# EasyEDA Pro project ProPrj_WriteBotDriver_2025-05-26.epro, schematic Schematic

## Sheets
1 MCU: Board Name: Board1; Create Date: 2025-04-28; Page Name: MCU; Project Name: WriteBotDriver; Schematic Name: Schematic; Update Date: 2025-05-12; Company: 嘉立创EDA; Page Size: A4; Version: V1.0
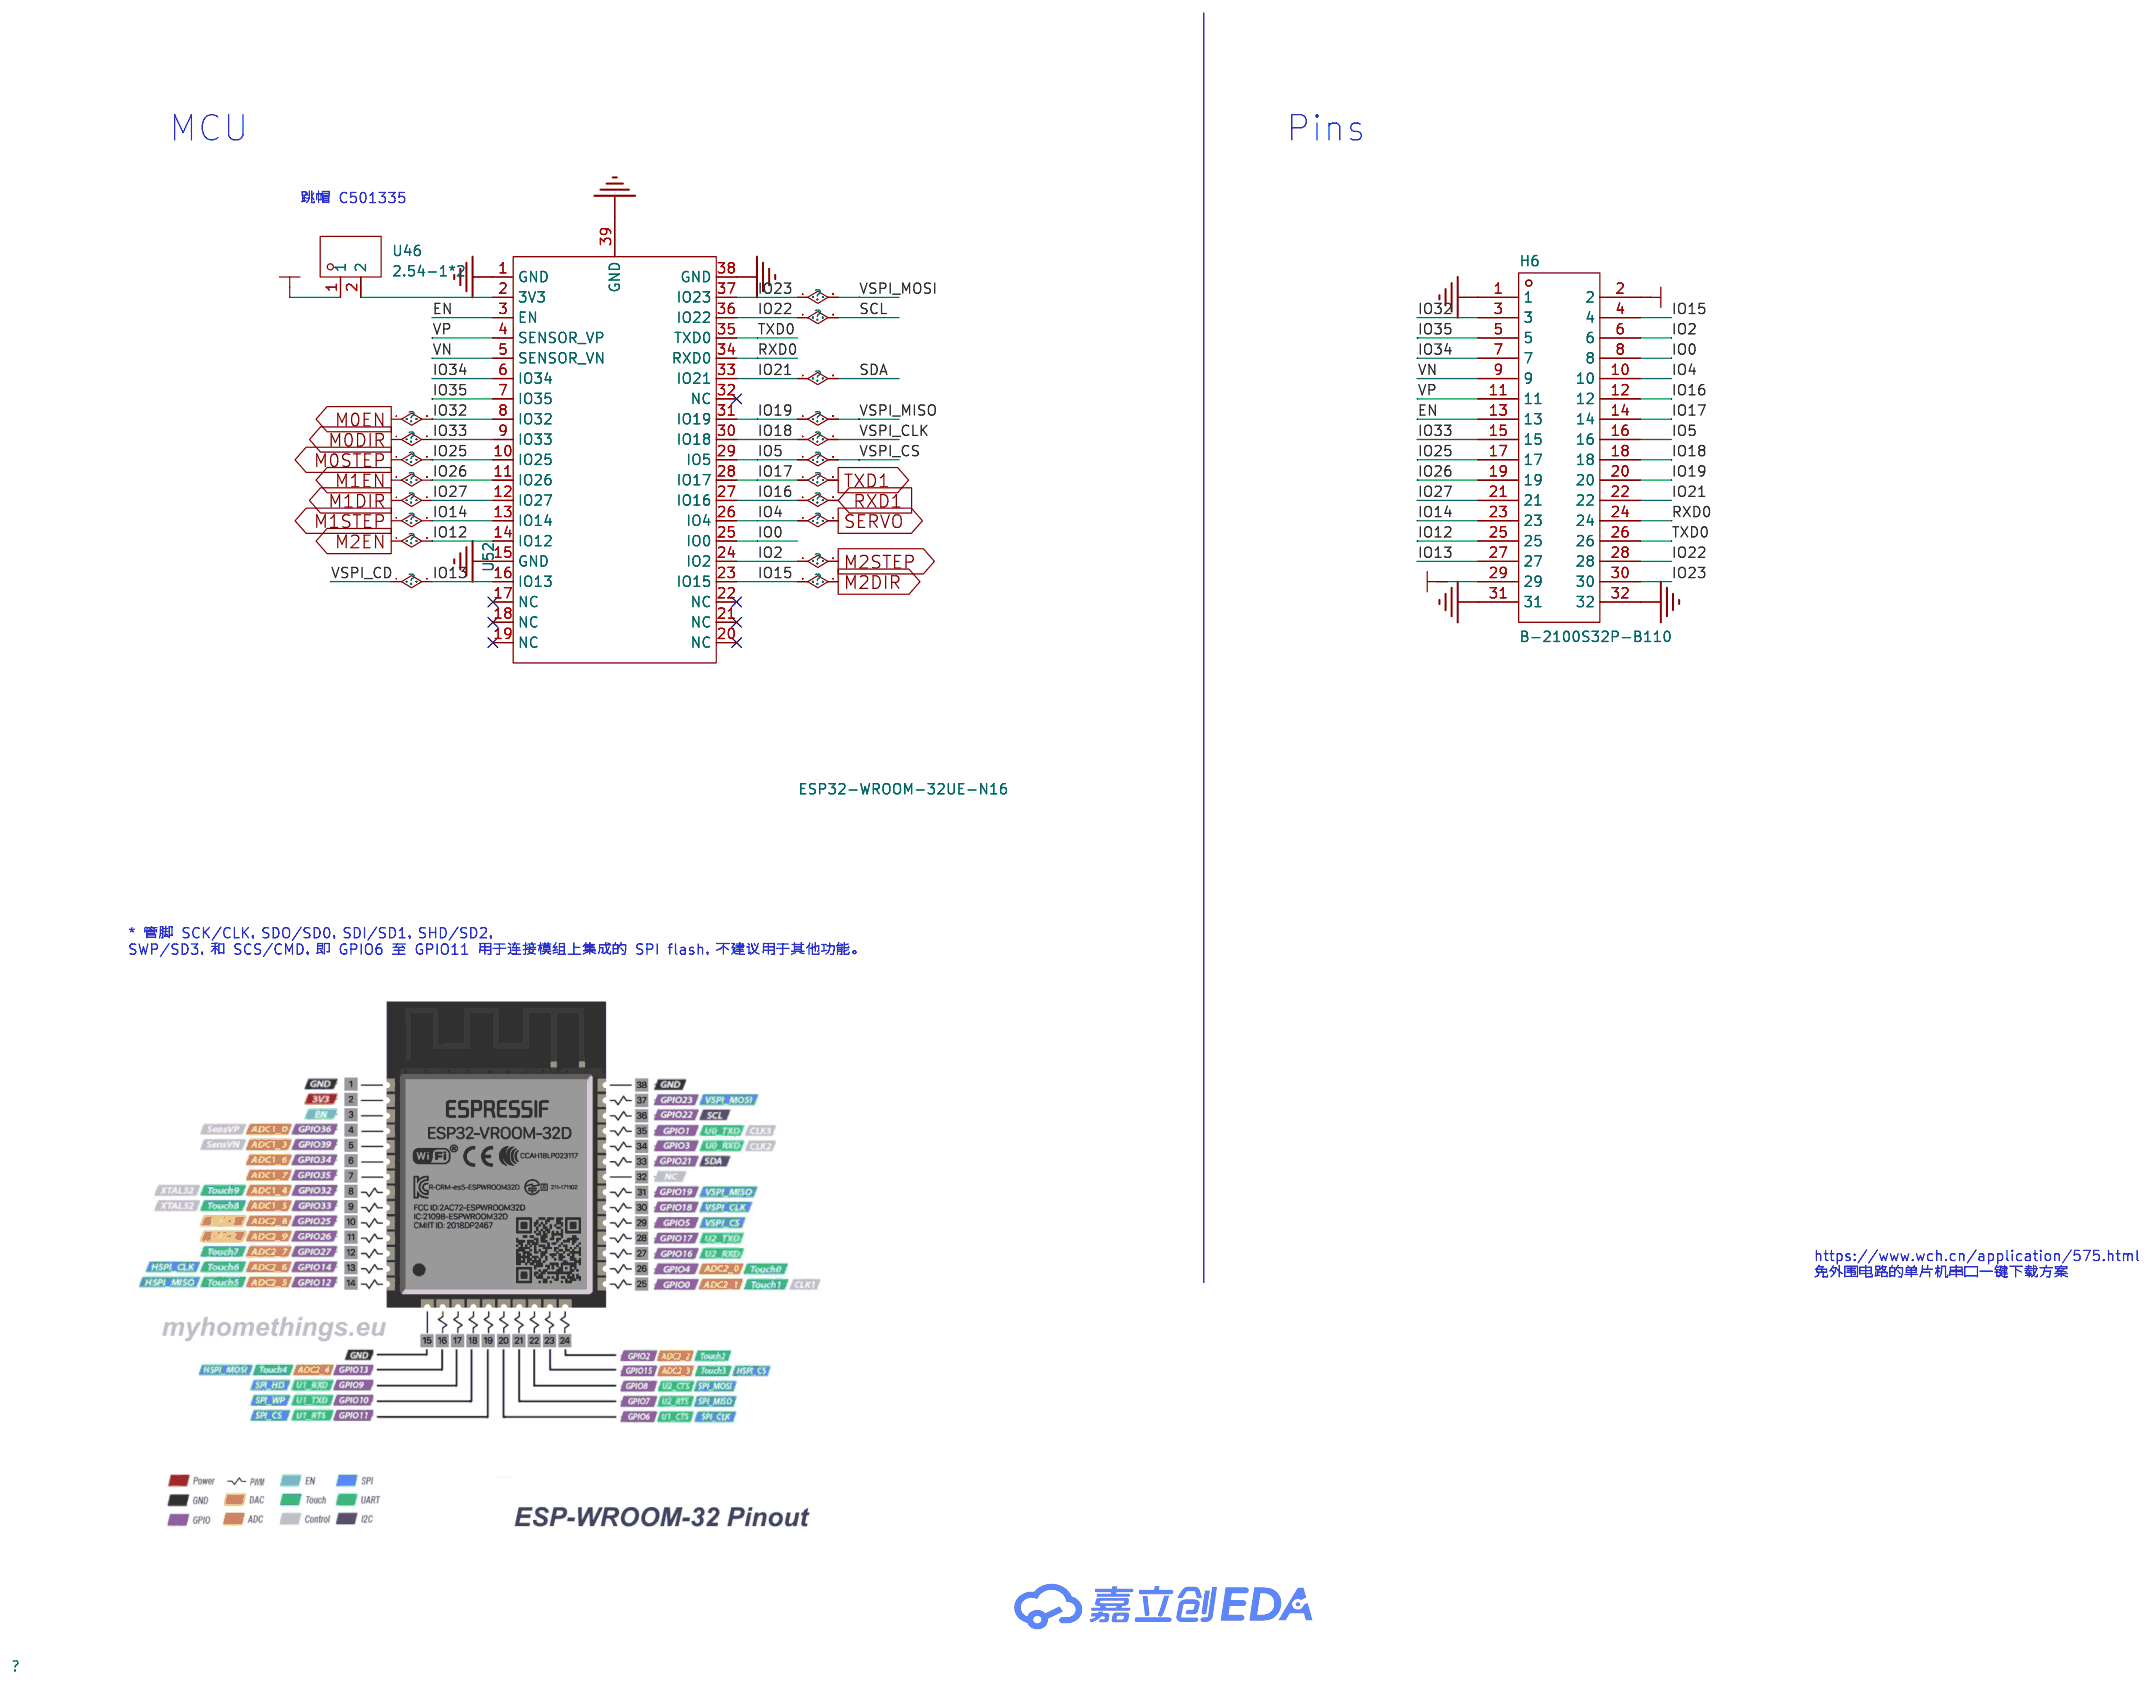
[diagram p0: MCU]
2 DRIVER: Page Name: DRIVER; Update Date: 2025-05-17
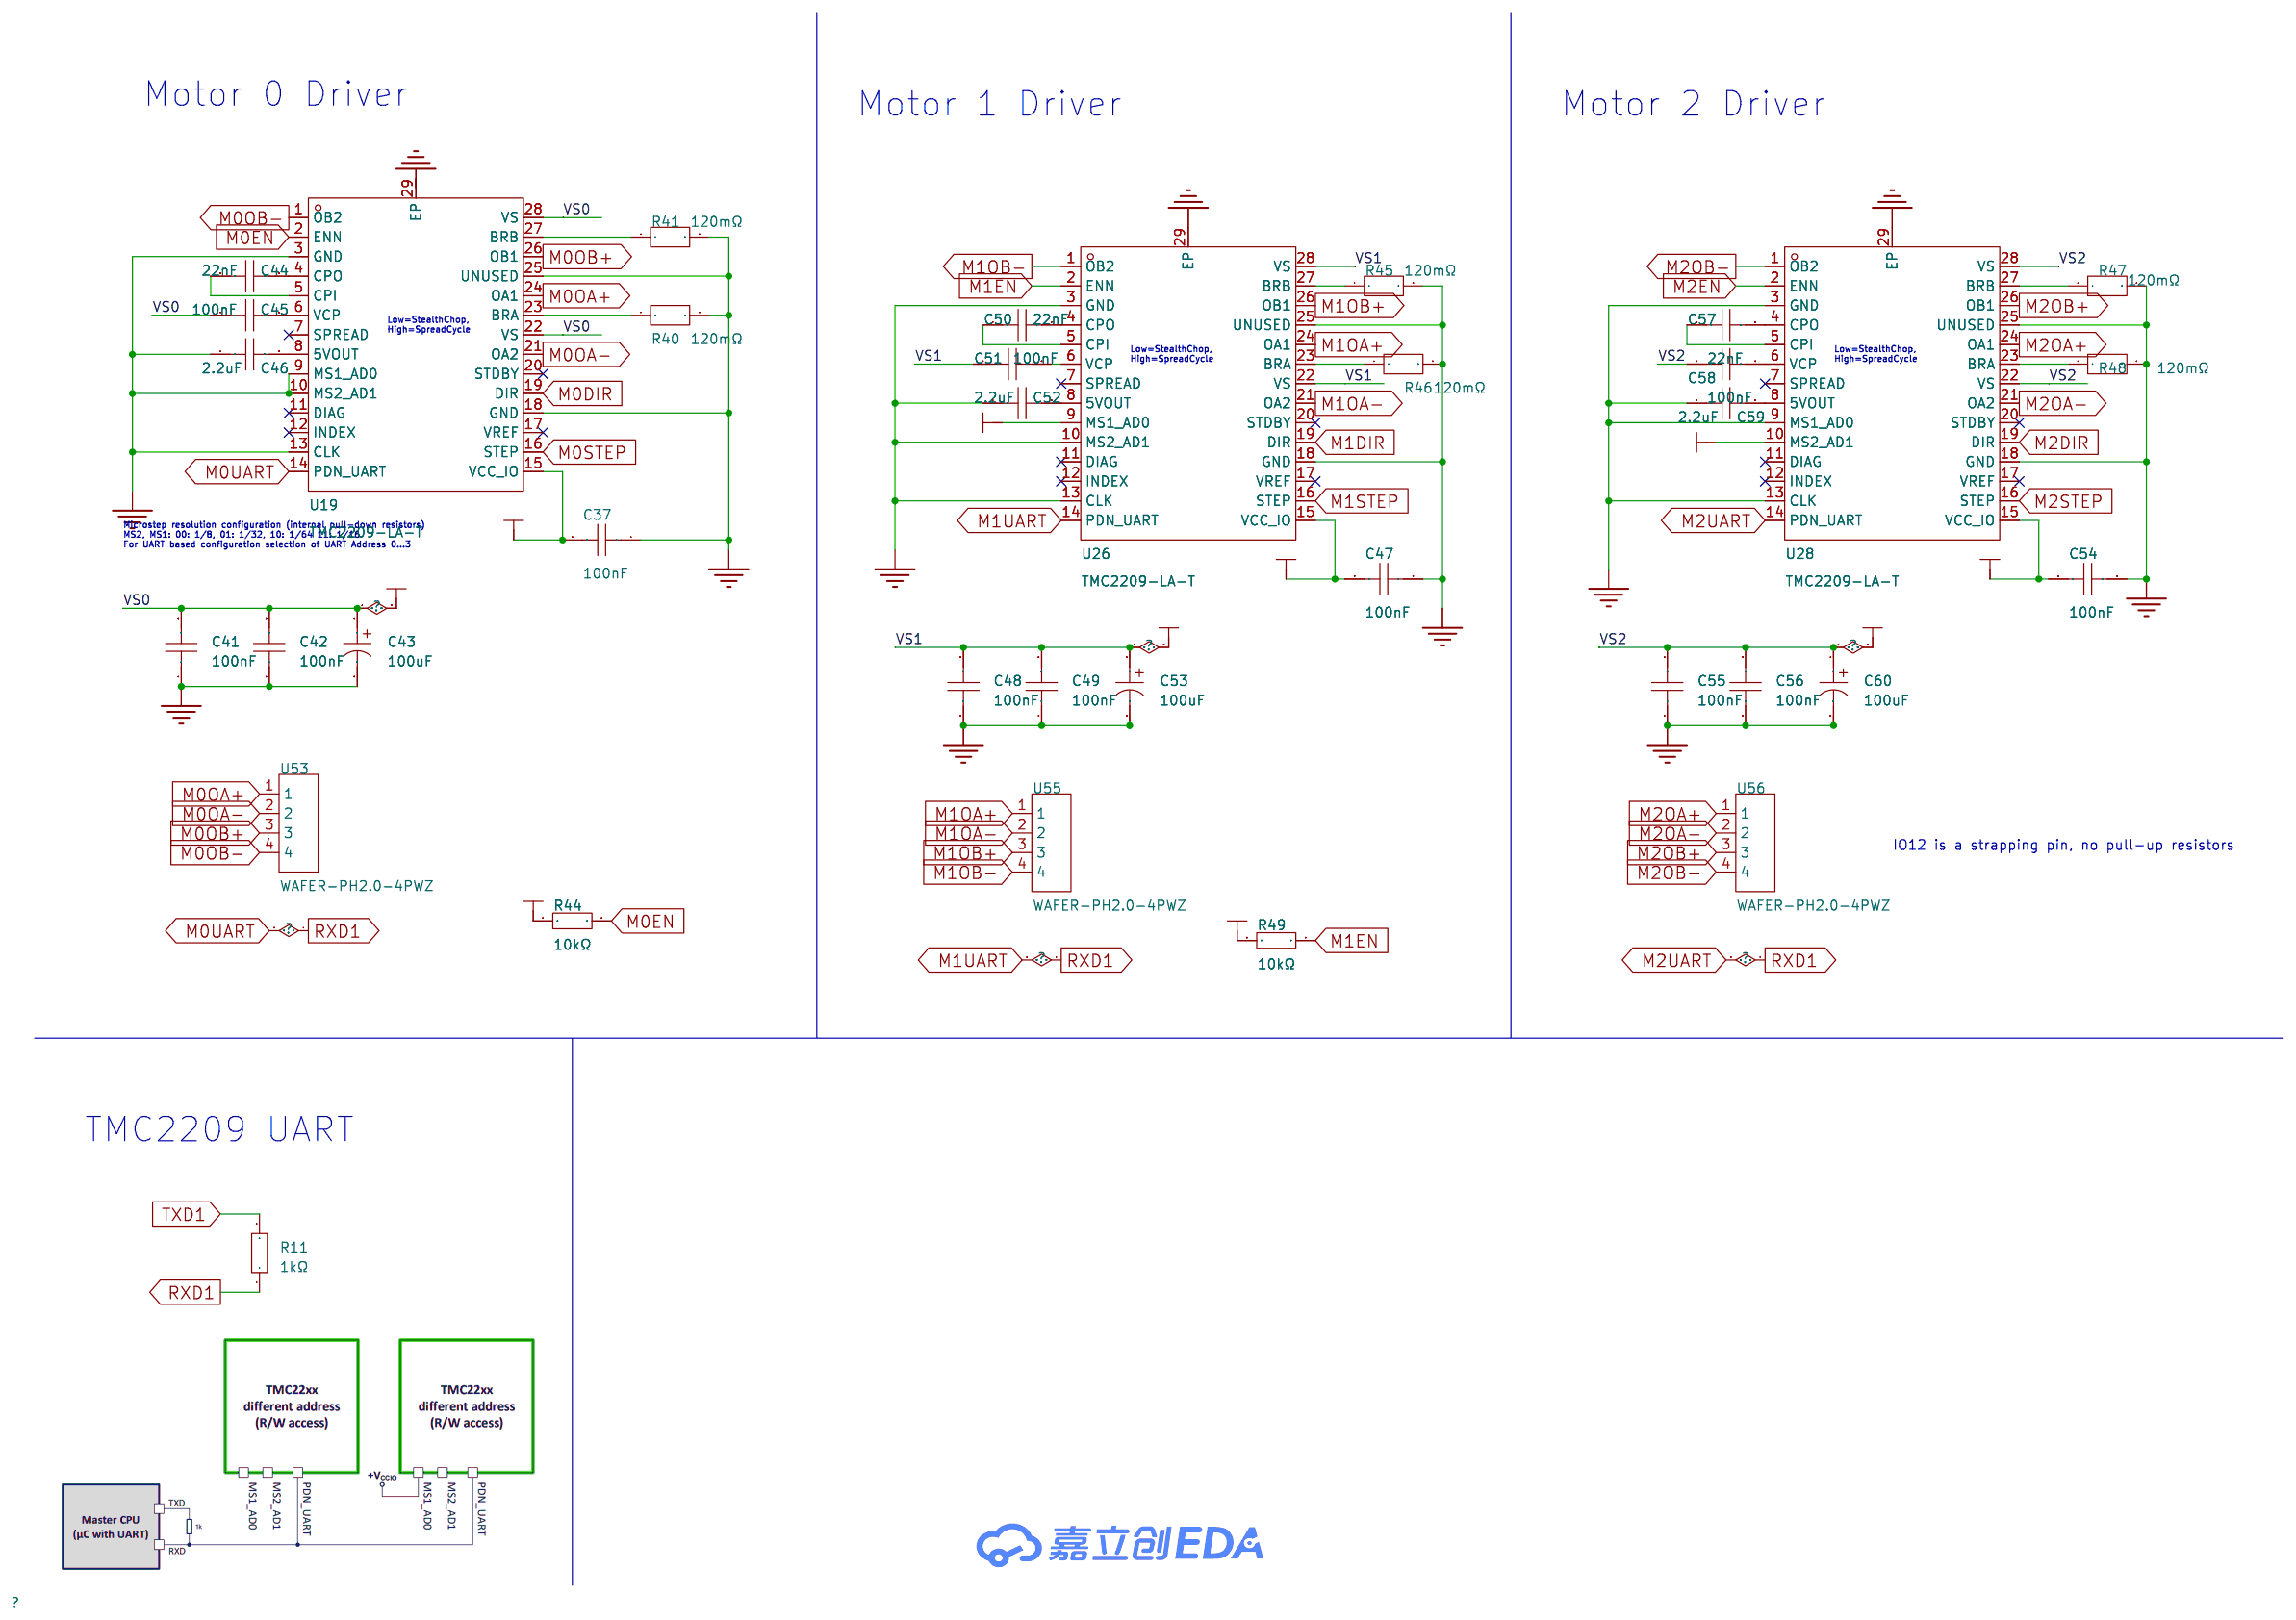
[diagram p1: DRIVER]
3 POWER: Page Name: POWER
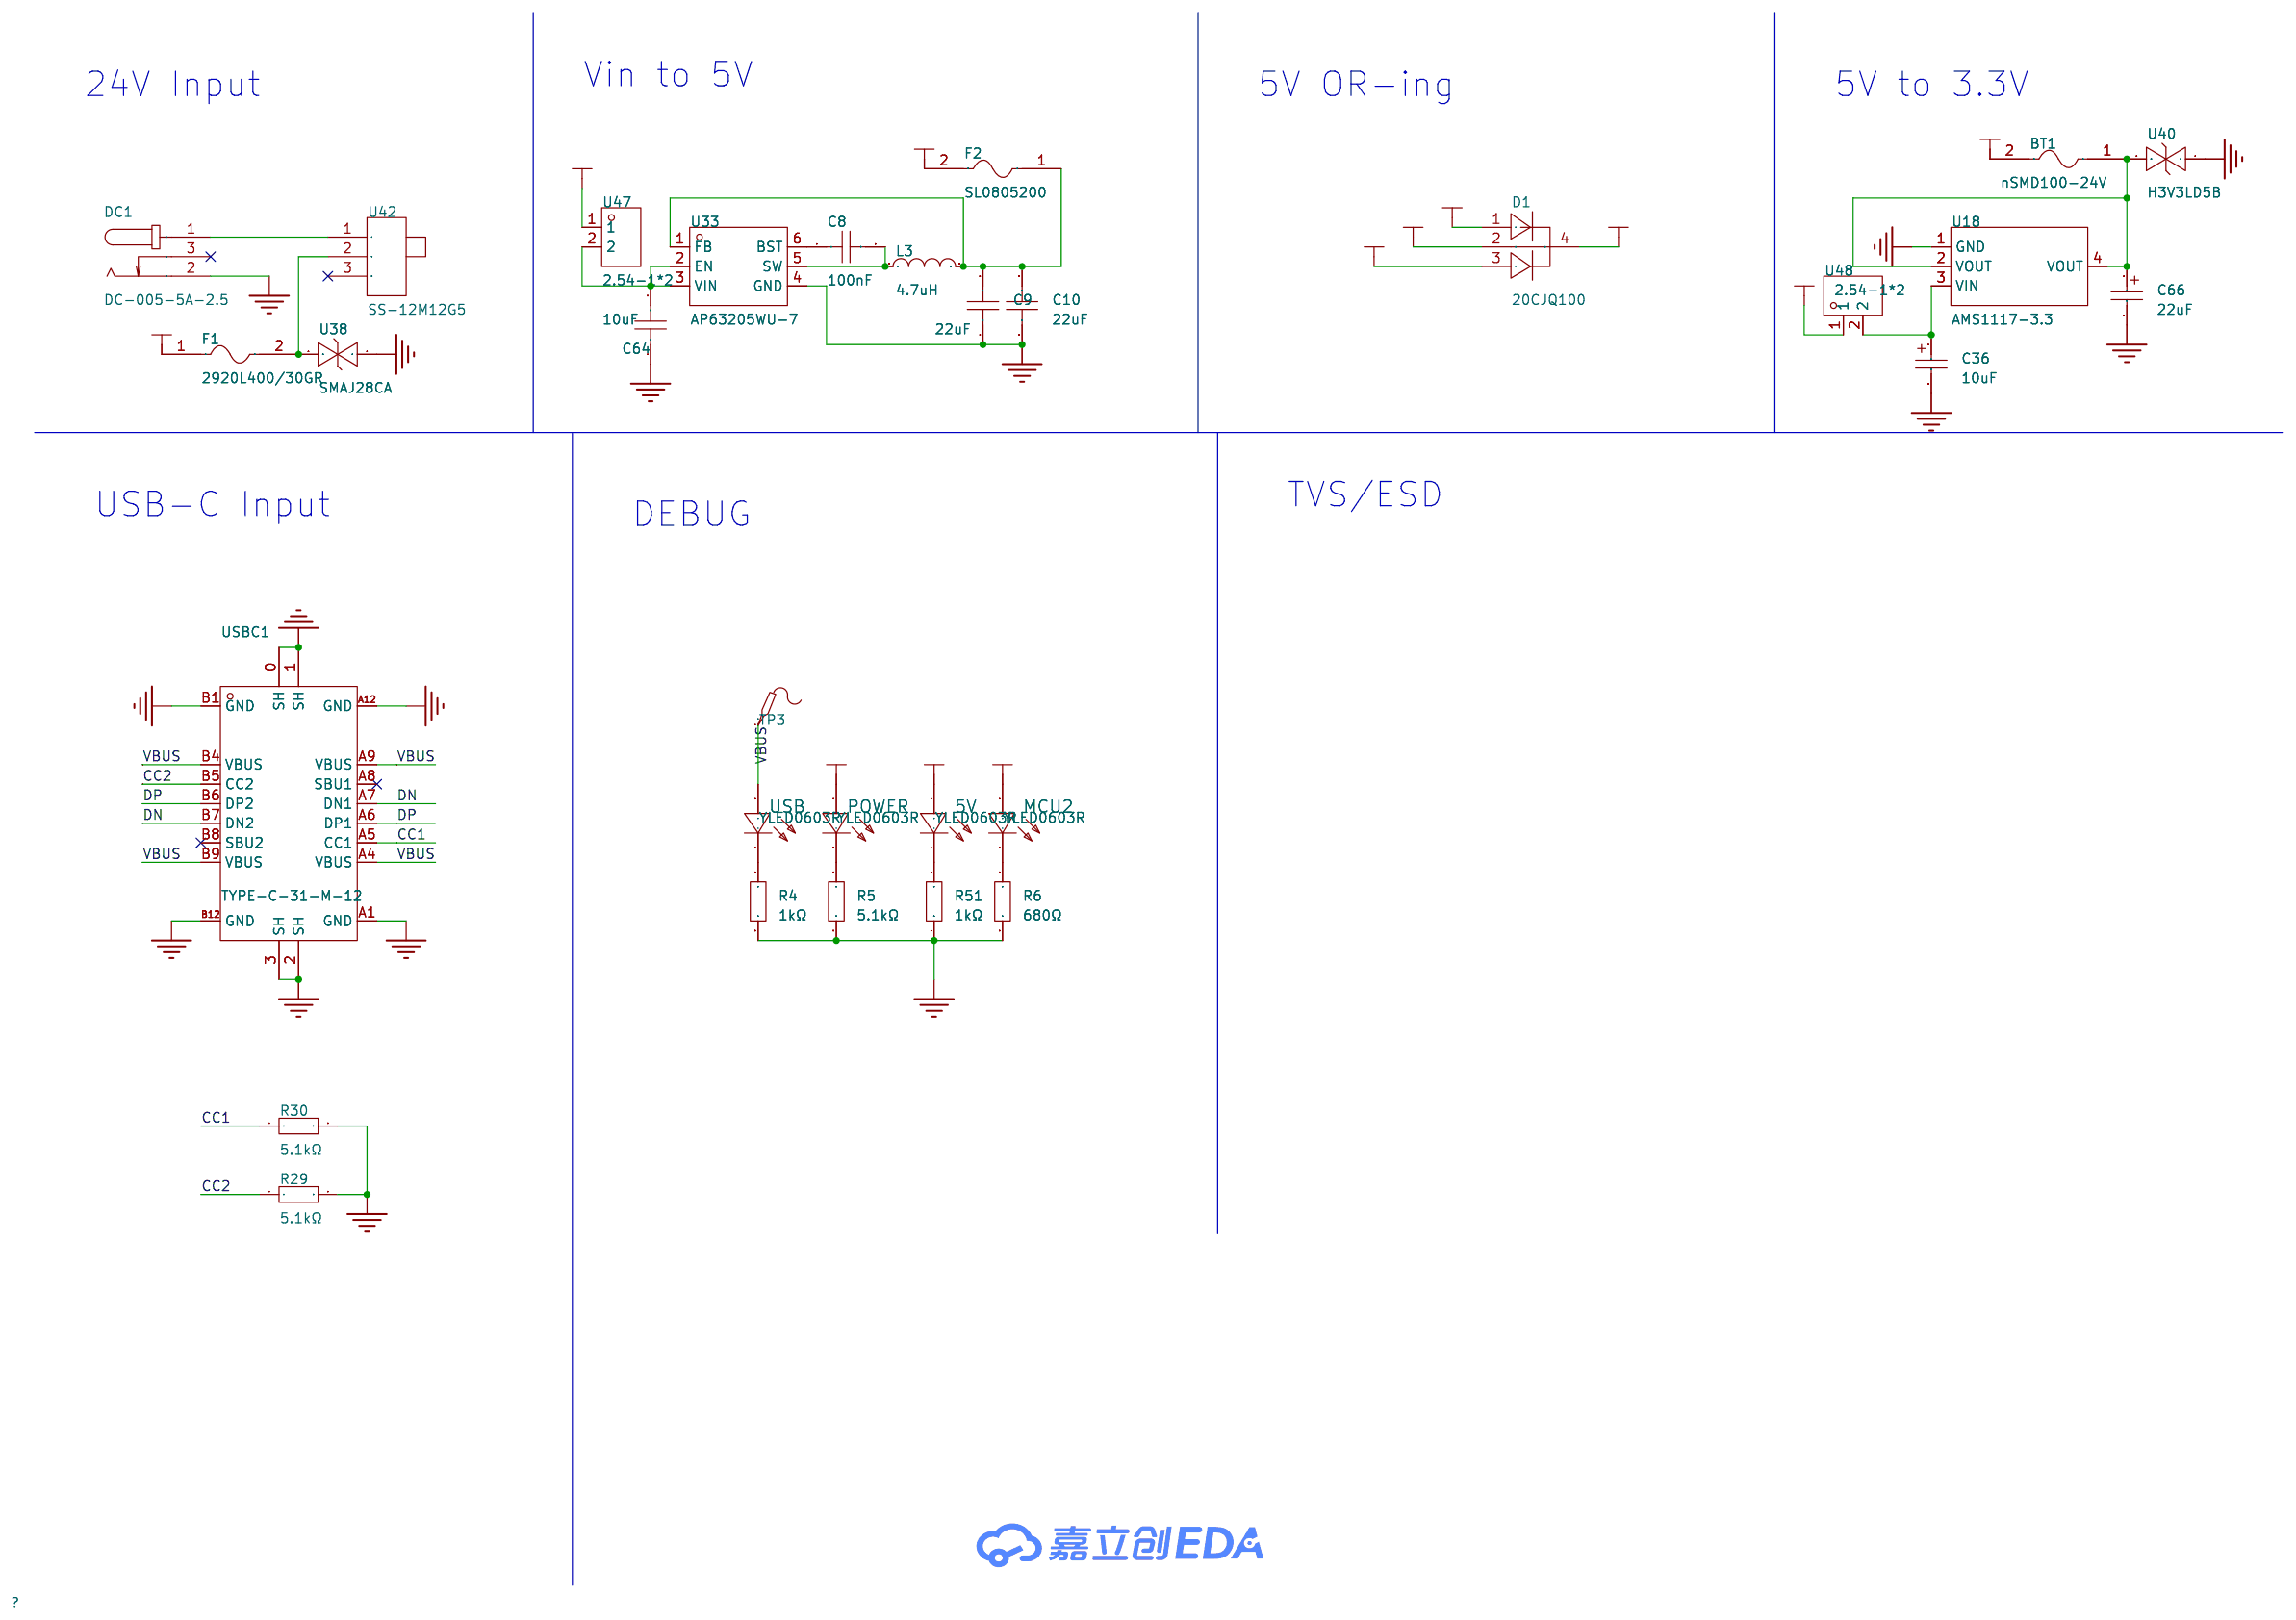
[diagram p2: POWER]
4 UART: Create Date: 2025-05-11; Page Name: UART; Update Date: 2025-05-17
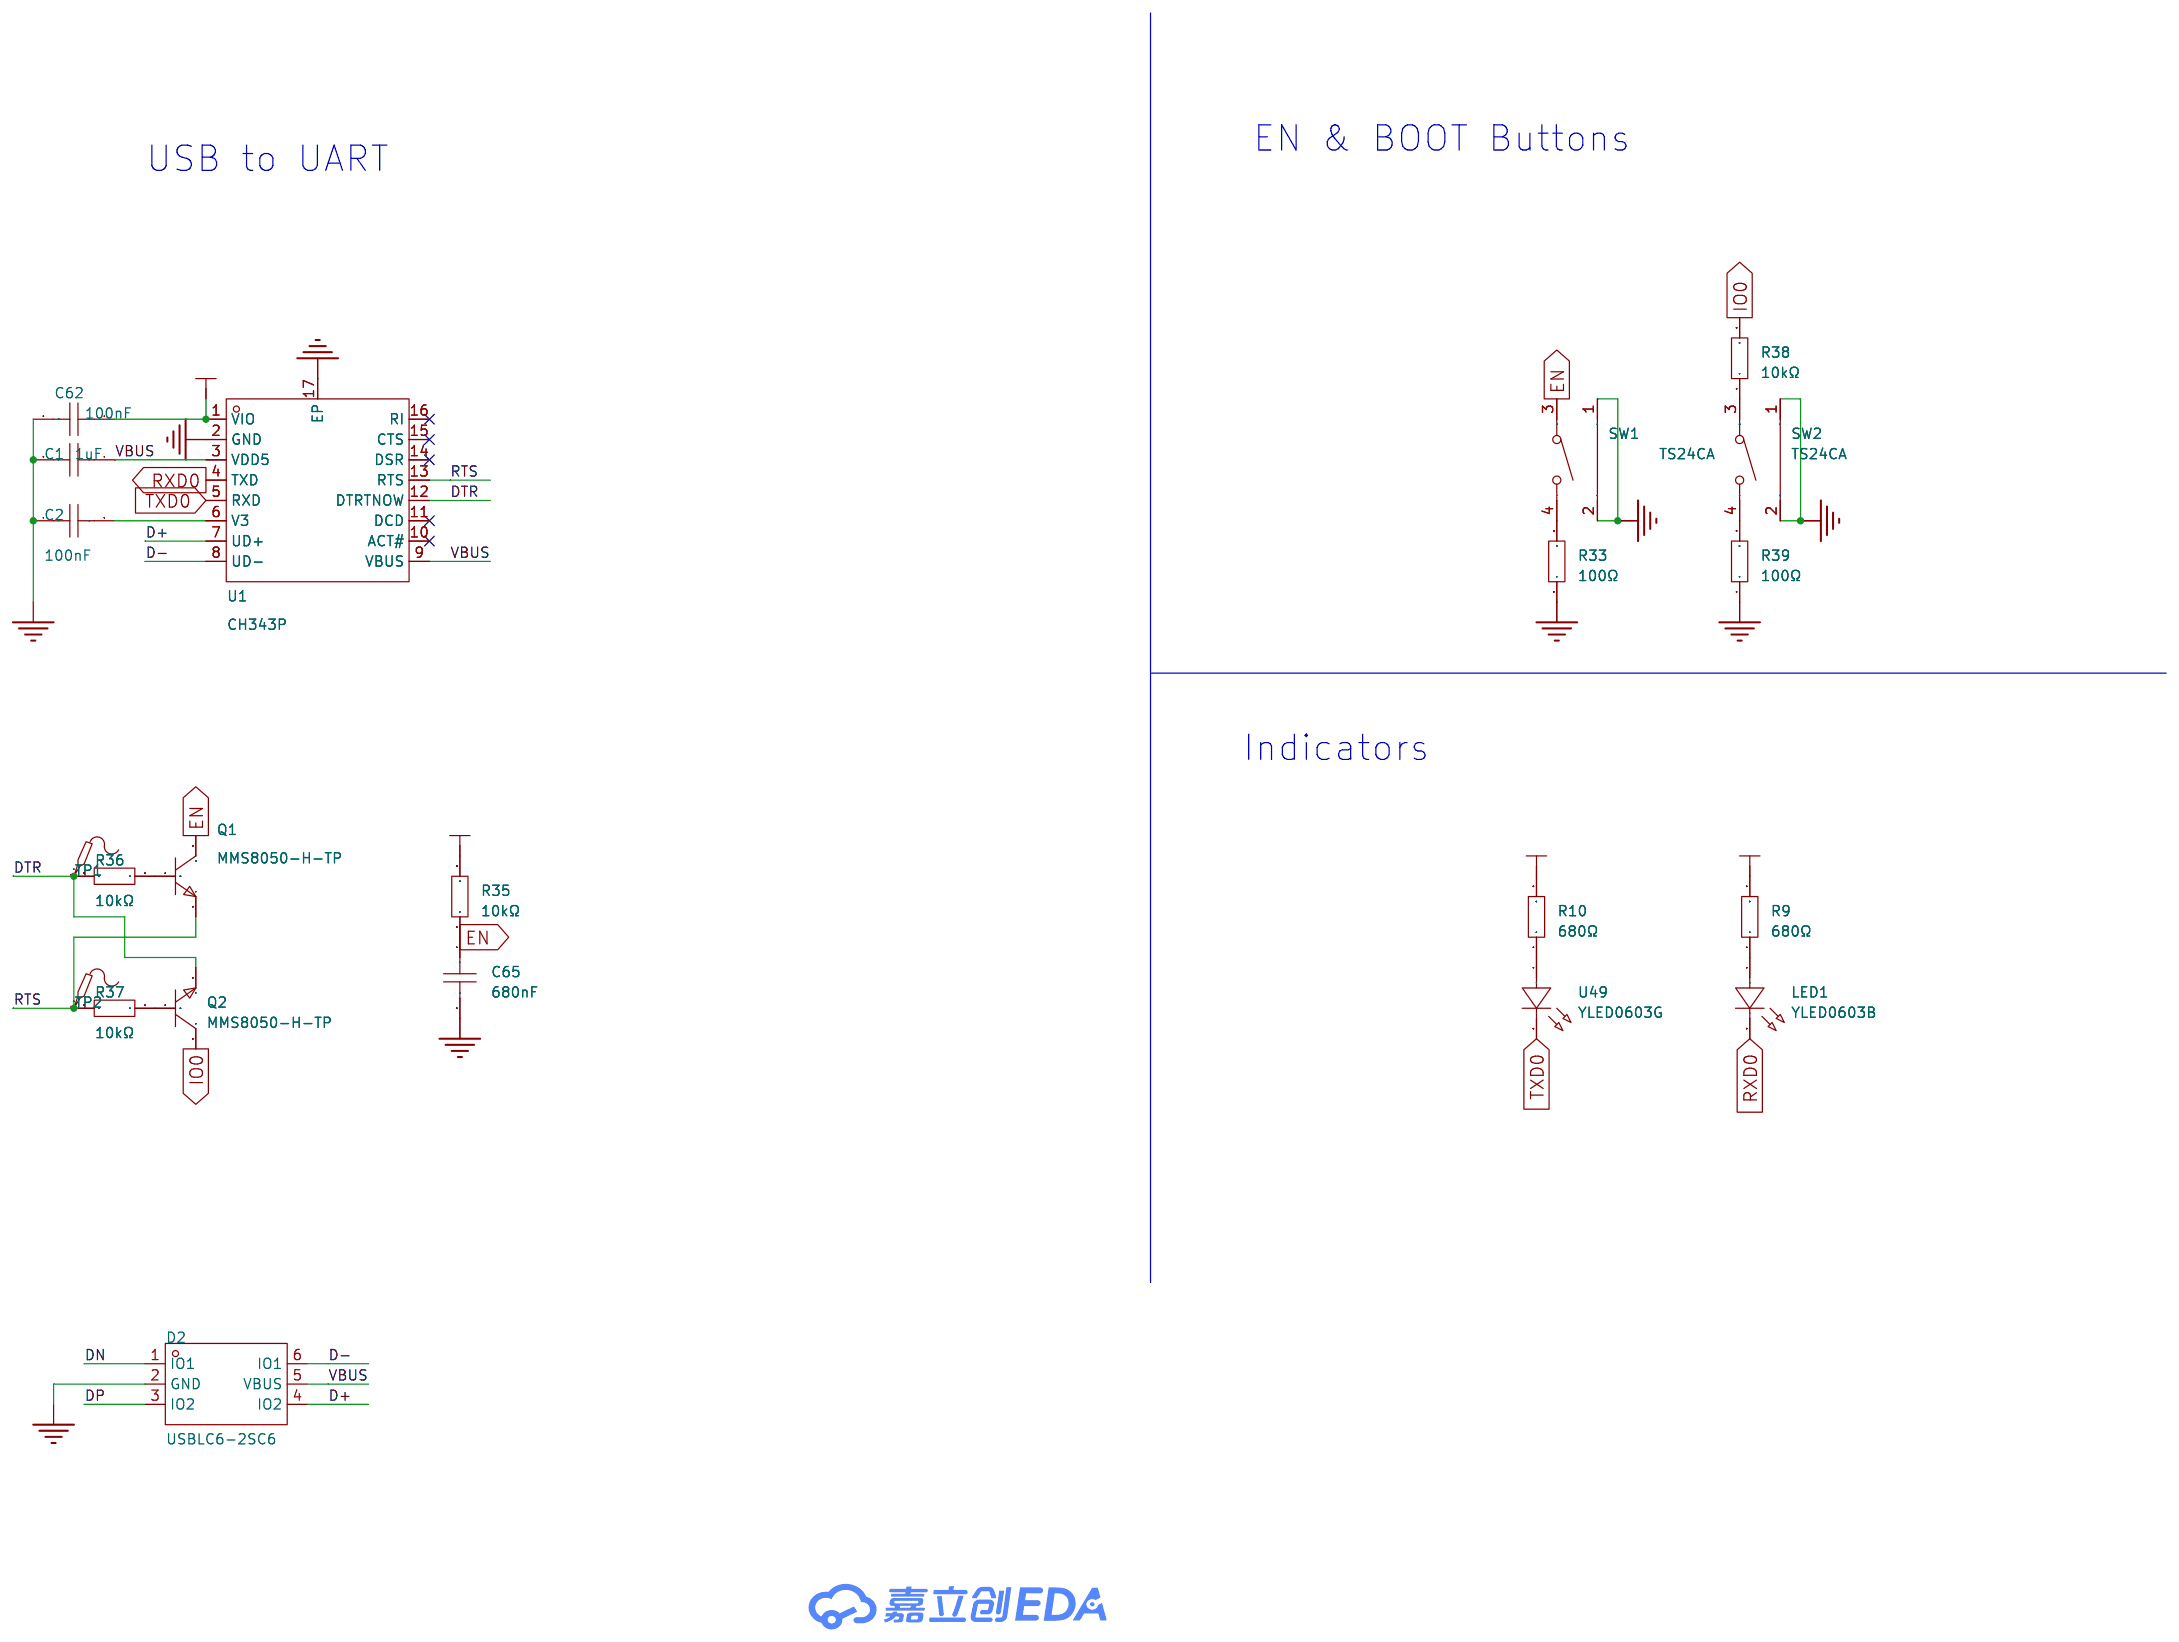
[diagram p3: UART]
5 PERIPHERALS: Create Date: 2025-05-11; Page Name: PERIPHERALS; Update Date: 2025-05-15
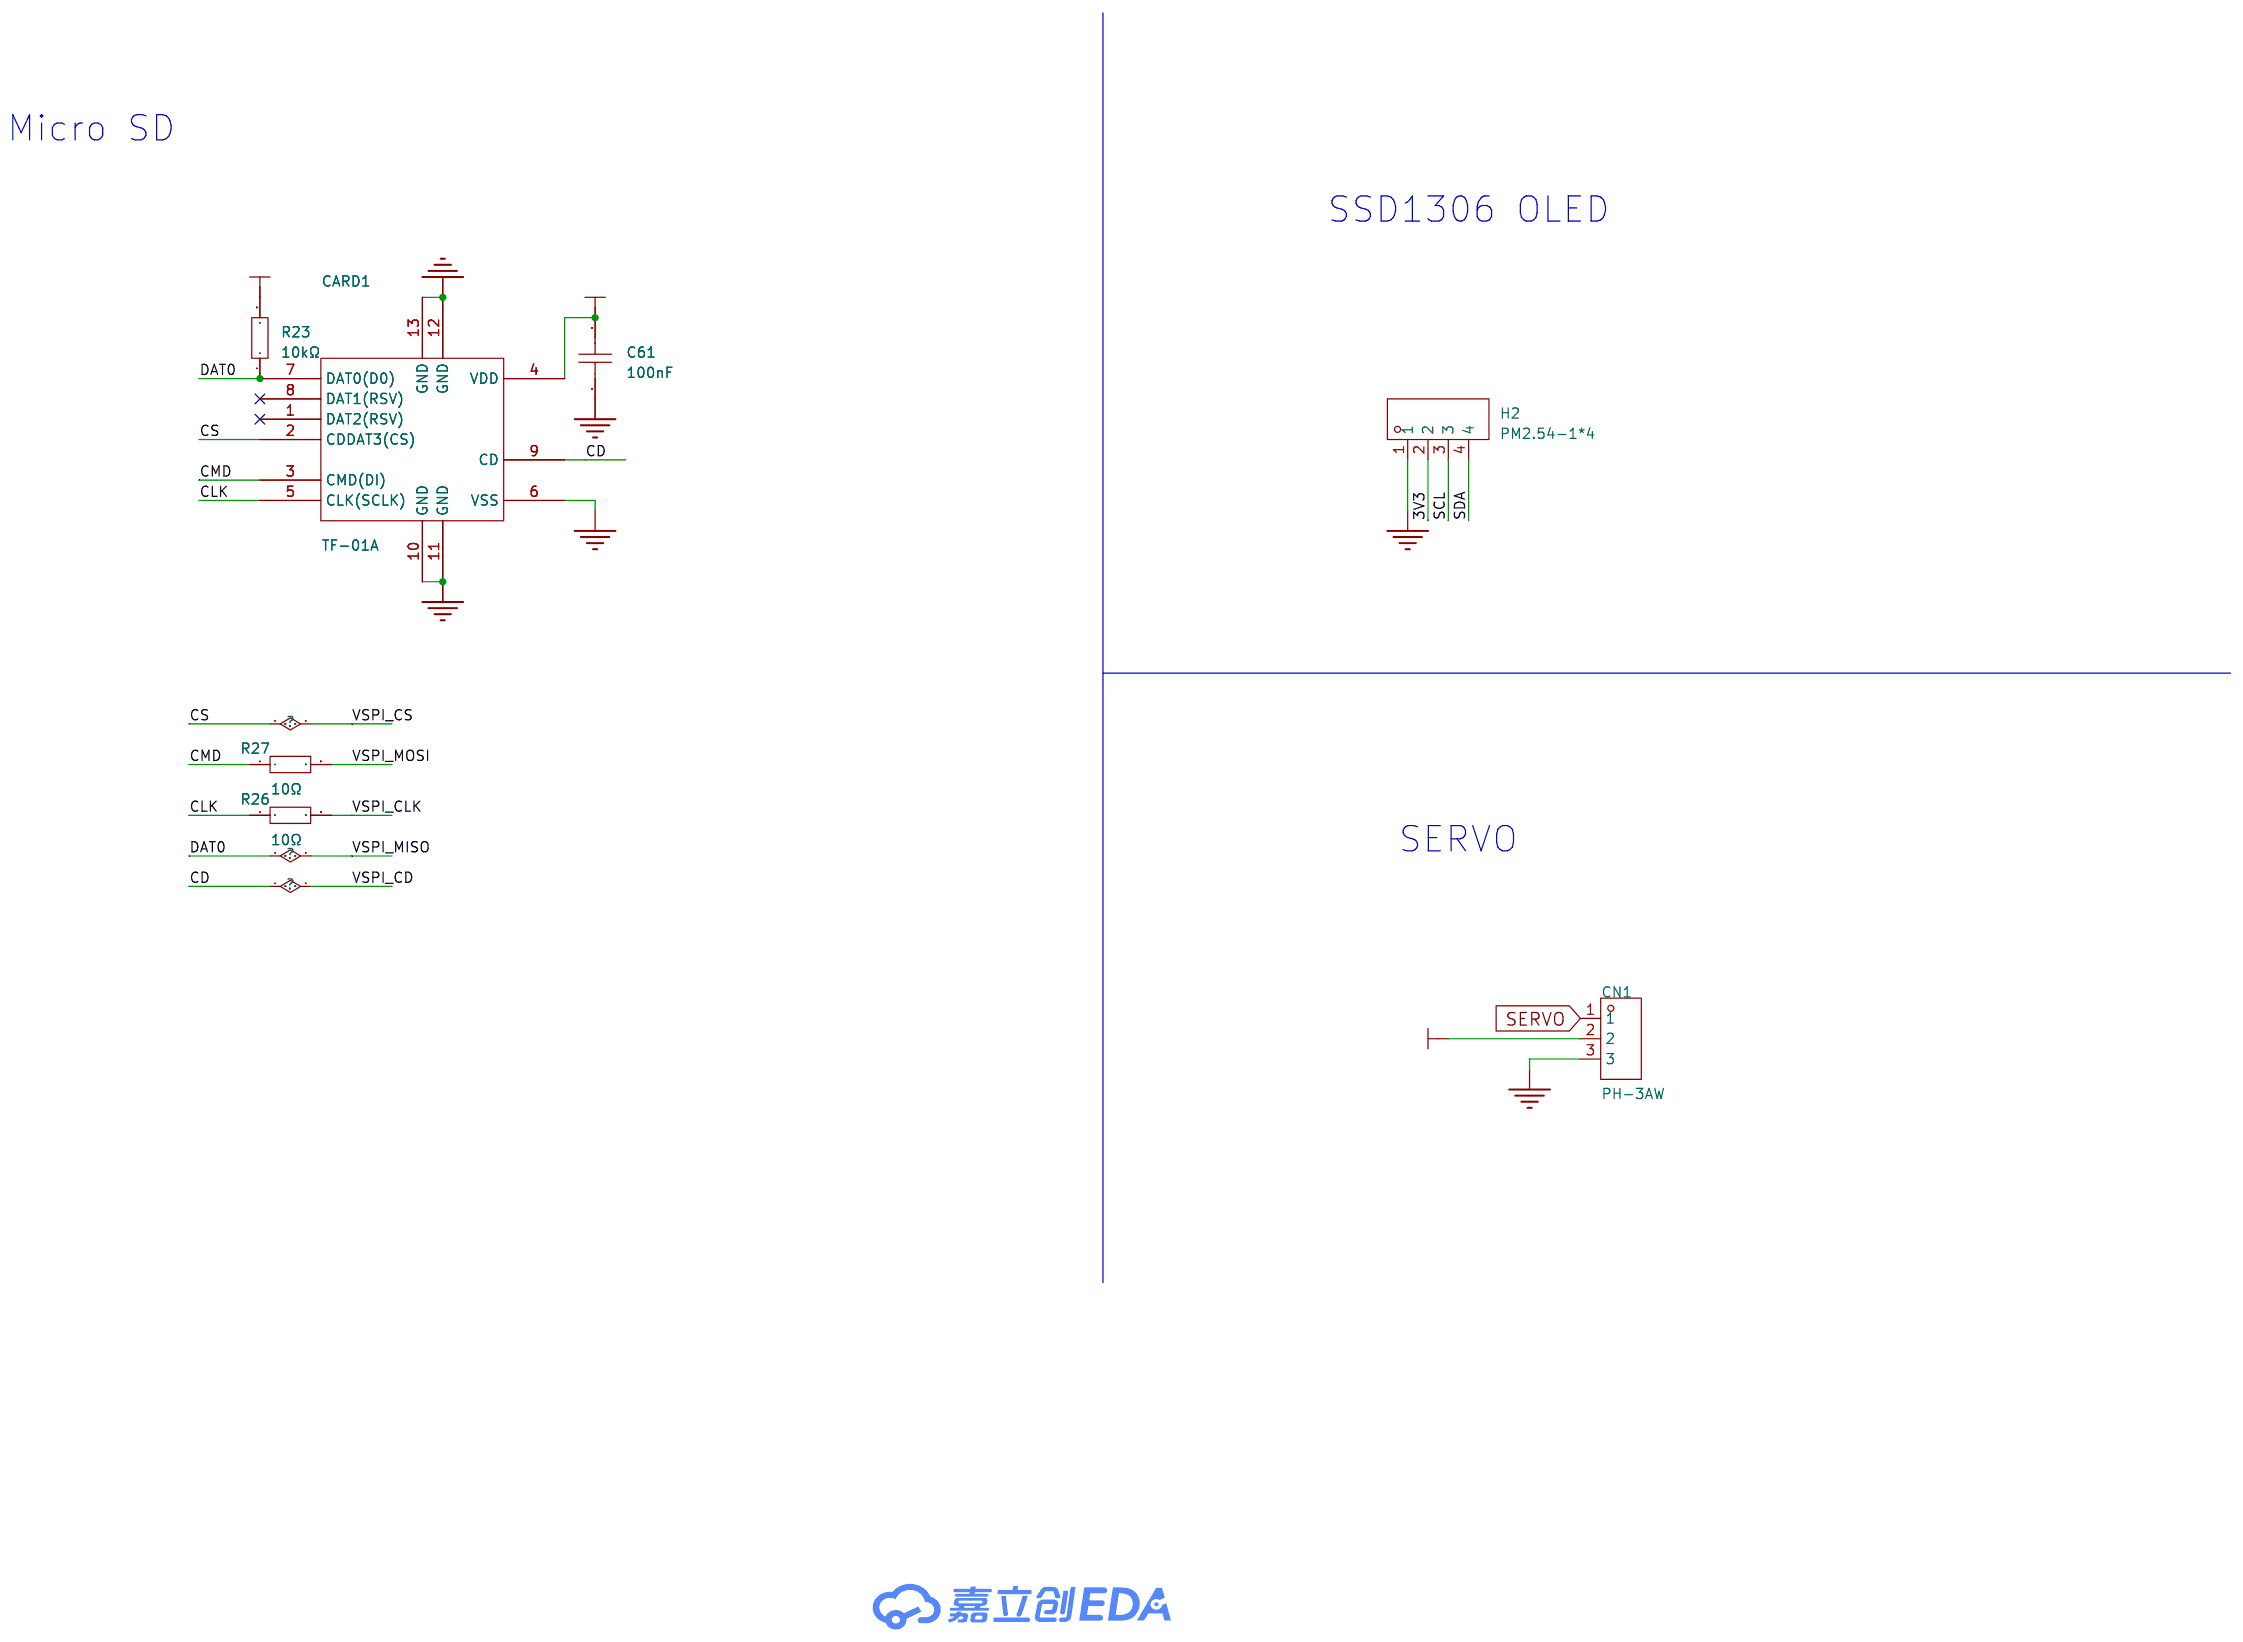
[diagram p4: PERIPHERALS]

## Parts
sheet DRIVER
C37  100nF  [C0603]
C41  100nF  [C0603]
C42  100nF  [C0603]
C43  100uF  [CAP-SMD_BD6.3-L6.5-W6.5-LS7.2-FD]
C44  22nF  [C0603]
C45  100nF  [C0603]
C46  2.2uF  [C0603]
C47  100nF  [C0603]
C48  100nF  [C0603]
C49  100nF  [C0603]
C50  22nF  [C0603]
C51  100nF  [C0603]
C52  2.2uF  [C0603]
C53  100uF  [CAP-SMD_BD6.3-L6.5-W6.5-LS7.2-FD]
C54  100nF  [C0603]
C55  100nF  [C0603]
C56  100nF  [C0603]
C57  22nF  [C0603]
C58  100nF  [C0603]
C59  2.2uF  [C0603]
C60  100uF  [CAP-SMD_BD6.3-L6.5-W6.5-LS7.2-FD]
R11  1kΩ  [R0603]
R40  120mΩ  [R1206]
R41  120mΩ  [R1206]
R44  10kΩ  [R0603]
R45  120mΩ  [R1206]
R46  120mΩ  [R1206]
R47  120mΩ  [R1206]
R48  120mΩ  [R1206]
R49  10kΩ  [R0603]
U19  TMC2209-LA-T  [QFN-28_L5.0-W5.0-P0.50-BL-EP]
U26  TMC2209-LA-T  [QFN-28_L5.0-W5.0-P0.50-BL-EP]
U28  TMC2209-LA-T  [QFN-28_L5.0-W5.0-P0.50-BL-EP]
U53  WAFER-PH2.0-4PWZ  [CONN-TH_4P-P2.00_BX-PH2.0-4PWZ]
U55  WAFER-PH2.0-4PWZ  [CONN-TH_4P-P2.00_BX-PH2.0-4PWZ]
U56  WAFER-PH2.0-4PWZ  [CONN-TH_4P-P2.00_BX-PH2.0-4PWZ]
sheet MCU
H6  B-2100S32P-B110  [HDR-TH_32P-P2.54-V-M-R2-C16-S2.54]
U46  2.54-1*2  [HDR-TH_2P-P2.54-V-M]
U52  ESP32-WROOM-32UE-N16  [COMM-SMD_ESP32-WROOM-32UE-N16]
sheet PERIPHERALS
C61  100nF  [C0603]
CARD1  TF-01A  [TF-SMD_TF-01A]
CN1  PH-3AW  [CONN-TH_3P-P2.00_HCTL_PH-3AW_C2908635]
H2  PM2.54-1*4  [HDR-TH_4P-P2.54-V-F]
R23  10kΩ  [R0603]
R26  10Ω  [R0603]
R27  10Ω  [R0603]
sheet POWER
5V  YLED0603R  [LED0603-FD]
BT1  nSMD100-24V  [F1206]
C8  100nF  [C0603]
C9  22uF  [C0603]
C10  22uF  [C0603]
C36  10uF  [CAP-SMD_L3.2-W1.6-RD-C7171]
C64  10uF  [C1206]
C66  22uF  [CASE-A_3216]
D1  20CJQ100  [SOT-223-3_L6.5-W3.4-P2.30-LS7.0-BR]
DC1  DC-005-5A-2.5  [DC-IN-TH_DC-005-5A-2.5]
F1  2920L400/30GR  [F2920]
F2  SL0805200  [F0805]
L3  4.7uH  [IND-SMD_L4.5-W4.1_IHLP]
MCU2  YLED0603R  [LED0603-FD]
POWER  YLED0603R  [LED0603-FD]
R4  1kΩ  [R0603]
R5  5.1kΩ  [R0603]
R6  680Ω  [R0603]
R29  5.1kΩ  [R0603]
R30  5.1kΩ  [R0603]
R51  1kΩ  [R0603]
TP3  -  [Test-Point-0.5mm]
U18  AMS1117-3.3  [SOT-223-3_L6.5-W3.4-P2.30-LS7.0-BR]
U33  AP63205WU-7  [TSOT-23-6_L2.9-W1.6-P0.95-LS2.8-BL]
U38  SMAJ28CA  [DO-214AC_L4.3-W2.7-LS5.0-BI]
U40  H3V3LD5B  [SOD-523F_L1.7-W0.9-LS1.7-BI]
U42  SS-12M12G5  [SW-TH_SS-12M12G5]
U47  2.54-1*2  [HDR-TH_2P-P2.54-V-M]
U48  2.54-1*2  [HDR-TH_2P-P2.54-V-M]
USB  YLED0603R  [LED0603-FD]
USBC1  TYPE-C-31-M-12  [USB-C_SMD-TYPE-C-31-M-12]
sheet UART
C1  1uF  [C0603]
C2  100nF  [C0603]
C62  100nF  [C0603]
C65  680nF  [C0603]
D2  USBLC6-2SC6  [SOT-23-6_L2.9-W1.6-P0.95-LS2.8-BL]
LED1  YLED0603B  [LED0603-FD]
Q1  MMS8050-H-TP  [SOT-23-3_L2.9-W1.3-P1.90-LS2.4-BR]
Q2  MMS8050-H-TP  [SOT-23-3_L2.9-W1.3-P1.90-LS2.4-BR]
R9  680Ω  [R0603]
R10  680Ω  [R0603]
R33  100Ω  [R0603]
R35  10kΩ  [R0603]
R36  10kΩ  [R0603]
R37  10kΩ  [R0603]
R38  10kΩ  [R0603]
R39  100Ω  [R0603]
SW1  TS24CA  [SW-SMD_TS24CA]
SW2  TS24CA  [SW-SMD_TS24CA]
TP1  -  [Test-Point-0.5mm]
TP2  -  [Test-Point-0.5mm]
U1  CH343P  [TQFN-16_L3.0-W3.0-P0.50-BL-EP1.7]
U49  YLED0603G  [LED0603-FD]

## Library data of the parts
C2 C8 C37 C41 C42 C47-C49 C54-C56 C62 = CL10B104KB8NNNC: 容值:100nF;精度:±10%;额定电压:50V;材质(温度系数):X7R;; LCSC Part Name: 100nF ±10% 50V; Supplier Part: C1591; Manufacturer: SAMSUNG(三星); Supplier Footprint: 0603; JLCPCB Part Class: Extended Part; Datasheet: https://atta.szlcsc.com/upload/public/pdf/source/20160218/1457707763339.pdf; Supplier: LCSC; Tolerance: ±10%; Voltage Rated: 50V; Temperature Coefficient: X7R
C43 C53 C60 = KNM2100UF35V149EC0055: 容值:100uF;精度:±20%;额定电压:35V;纹波电流:1.516A@100kHz;等效串联电阻:80mΩ@100kHz;; LCSC Part Name: 100uF ±20% 35V; Supplier Part: C2982822; Manufacturer: KNSCHA(科尼盛); Supplier Footprint: SMD,D6.3xL7mm; JLCPCB Part Class: 扩展库; Datasheet: https://atta.szlcsc.com/upload/public/pdf/source/20220426/5696DDB0B22BE88A3CF8D074D2573DF7.pdf; Supplier: LCSC; Tolerance: ±20%; Rated Voltage: 35V; Ripple Current: 1.516A@100kHz; Equivalent Series Resistance(ESR): 80mΩ@100kHz; Lead Spacing: 2.5mm; φD: 6.3mm; L: 7mm; Lifetime @ Temp: 2000hrs@105℃; Operating Temperature: -55℃~+105℃
C44 C50 C57 = CL10B223KB8NNNC: 容值:22nF;精度:±10%;额定电压:50V;材质(温度系数):X7R;; LCSC Part Name: 22nF ±10% 50V; Supplier Part: C21122; Manufacturer: SAMSUNG(三星); Supplier Footprint: 0603; JLCPCB Part Class: Basic Part; Datasheet: https://atta.szlcsc.com/upload/public/pdf/source/20160218/1457707763339.pdf; Supplier: LCSC; Tolerance: ±10%; Voltage Rated: 50V; Temperature Coefficient: X7R
C45 C51 C58 = CC0603KRX7R9BB104: 容值:100nF;精度:±10%;额定电压:50V;材质(温度系数):X7R;; LCSC Part Name: 100nF ±10% 50V; Supplier Part: C14663; Manufacturer: YAGEO(国巨); Supplier Footprint: 0603; JLCPCB Part Class: Basic Part; Datasheet: https://atta.szlcsc.com/upload/public/pdf/source/20180910/C282072_33301C7F631E79921B82A8DAC6BCC5B3.pdf; Supplier: LCSC; Tolerance: ±10%; Voltage Rated: 50V; Temperature Coefficient: X7R
C46 C52 C59 = CL10A225KO8NNNC: 容值:2.2uF;精度:±10%;额定电压:16V;材质(温度系数):X5R;; LCSC Part Name: 2.2uF ±10% 16V; Supplier Part: C23630; Manufacturer: SAMSUNG(三星); Supplier Footprint: 0603; JLCPCB Part Class: Basic Part; Datasheet: https://atta.szlcsc.com/upload/public/pdf/source/20160218/1457707763339.pdf; Supplier: LCSC; Tolerance: ±10%; Voltage Rated: 16V; Temperature Coefficient: X5R
R4 R11 R51 = 0603WAF1001T5E: 电阻类型:厚膜电阻;阻值:1kΩ;精度:±1%;功率:100mW;最大工作电压:75V;温度系数:±100ppm/℃;; LCSC Part Name: 1kΩ ±1% 100mW 厚膜电阻; Supplier Part: C21190; Manufacturer: UNI-ROYAL(厚声); Supplier Footprint: 0603; JLCPCB Part Class: Basic Part; Datasheet: https://atta.szlcsc.com/upload/public/pdf/source/20200306/C422600_1E6D84923E4A46A82E41ADD87F860B5C.pdf; Supplier: LCSC; Type: 厚膜电阻; Tolerance: ±1%; Power(Watts): 100mW; Overload Voltage (Max): 75V; Temperature Coefficient: ±100ppm/℃; Operating Temperature Range: -55℃~+155℃
R40 R41 R45-R48 = HP06W2F120LT5E: 电阻类型:厚膜电阻;阻值:120mΩ;精度:±1%;功率:500mW;最大工作电压:200V;; LCSC Part Name: 120mΩ ±1% 500mW 厚膜电阻; Supplier Part: C2759200; Manufacturer: UNI-ROYAL(厚声); Supplier Footprint: 1206; Supplier: LCSC; Type: 厚膜电阻; Tolerance: ±1%; Power(Watts): 500mW; Overload Voltage (Max): 200V; Operating Temperature Range: -55℃~+155℃
R23 R35-R38 R44 R49 = 0603WAF1002T5E: 电阻类型:厚膜电阻;阻值:10kΩ;精度:±1%;功率:100mW;最大工作电压:75V;温度系数:±100ppm/℃;; LCSC Part Name: 厚膜电阻 10kΩ ±1% 100mW; Supplier Part: C25804; Manufacturer: UNI-ROYAL(厚声); Supplier Footprint: 0603; JLCPCB Part Class: Basic Part; Datasheet: https://atta.szlcsc.com/upload/public/pdf/source/20200306/C422600_1E6D84923E4A46A82E41ADD87F860B5C.pdf; Supplier: LCSC; Type: 厚膜电阻; Tolerance: ±1%; Power(Watts): 100mW; Overload Voltage (Max): 75V; Temperature Coefficient: ±100ppm/℃; Operating Temperature Range: -55℃~+155℃
U19 U26 U28 = TMC2209-LA-T: LCSC Part Name: 2A 5.25V电机驱动芯片; Supplier Part: C2150710; Manufacturer: TRINAMIC; Supplier Footprint: QFN-28-EP(5x5); Datasheet: https://atta.szlcsc.com/upload/public/pdf/source/20210607/D0A4AAF613355E2D9215E68319997CCC.pdf; Supplier: LCSC
U53 U55 U56 = WAFER-PH2.0-4PWZ: 插针结构:1x4P;间距:2mm;安装方式:弯插;参考系列:PH;总PIN数:4P;排数:1;每排PIN数:4;行距:-;额定电流:2A;触头材质:黄铜;触头镀层:锡;工作温度:-25℃~+85℃;; LCSC Part Name: 1x4P 间距:2mm 弯插 系列:PH; Supplier Part: C5359612; Manufacturer: XUNPU(讯普); Supplier Footprint: 弯插,P=2mm; JLCPCB Part Class: 扩展库; Datasheet: https://atta.szlcsc.com/upload/public/pdf/source/20230728/47B07572F36CD4F6F91BE29B817CECA3.pdf; Supplier: LCSC; Pins Structure: 1x4P; Pitch: 2mm; Mounting Type: 弯插; Reference Series: PH; Number of Pins: 4P; Number of Rows: 1; Number of PINs Per Row: 4; Current Rating: 2A; Contact Material: 黄铜; Contact Plating: 锡; Operating Temperature: -25℃~+85℃; Voltage Rating: 250V; Plastic Material: PA66; Flame Retardant Rating: UL94V-0; Color: 白色; Z-Height of the Board: 4.7mm; X-Length of Bottom Edge on Board (Spacing Line): 10mm; Y-Width of Bottom Edge on Board: 6.05mm
H6 = B-2100S32P-B110: 插针结构:2x16P;间距:2.54mm;行距:2.54mm;圆针/方针:-;安装类型:直插;排数:双排;总PIN位数:32P;额定电流:-;额定电压:-;配合针长度:6mm;塑高:2.54mm;端接针长度:3mm;触头材质:黄铜;触头镀层:-;工作温度范围:-40℃~+105℃;颜色:黑色;; LCSC Part Name: 间距:2.54mm 2x16P 直插; Supplier Part: C124382; Manufacturer: Ckmtw(灿科盟); Supplier Footprint: 插件,P=2.54mm; JLCPCB Part Class: 扩展库; Datasheet: https://atta.szlcsc.com/upload/public/pdf/source/20180130/C169817_15172974075481323419.pdf; Supplier: LCSC; Pin Structure: 2x16P; Pitch: 2.54mm; Row Spacing: 2.54mm; Mounting Type: 直插; Number of Rows: 双排; Number of Pins: 32P; Length of Mating Pin: 6mm; Insulation Height: 2.54mm; Length of End Connection Pin: 3mm; Contact Material: 黄铜; Operating Temperature Range: -40℃~+105℃; Color: 黑色
U46-U48 = 2.54-1*2: 插针结构:1x2P;间距:2.54mm;排数:单排;总PIN位数:2P;触头镀层:金;; LCSC Part Name: 停产; Supplier Part: C5116481; Manufacturer: ZHOURI(洲日); Supplier Footprint: 插件,P=2.54mm; JLCPCB Part Class: 扩展库; Datasheet: https://atta.szlcsc.com/upload/public/pdf/source/20220729/DF18AADA08AA3A4F1D3B0508BB8F7248.pdf; Supplier: LCSC; Pin Structure: 1x2P; Pitch: 2.54mm; Number of Rows: 单排; Number of Pins: 2P; Contact Plating: 金
U52 = ESP32-WROOM-32UE-N16_C701346: ESP32-WROOM-32UE 集成 ESP32-D0WD-V3 芯片，具有?高的稳定性和安全性能。; LCSC Part Name: 通用型Wi-Fi+BT+BLE MCU模组; Supplier Part: C701346; Manufacturer: ESPRESSIF(乐鑫); Supplier Footprint: SMD,18x19.2mm; JLCPCB Part Class: 扩展库; Datasheet: https://atta.szlcsc.com/upload/public/pdf/source/20241030/447B1C85FFE3FB0A37F75624F2C6635F.pdf; Supplier: LCSC
C61 = CGA0603X7R104K500JT: 容值:100nF;精度:±10%;额定电压:50V;温度系数:X7R;; LCSC Part Name: 100nF ±10% 50V; Supplier Part: C6119867; Manufacturer: HRE(芯声); Supplier Footprint: 0603; Datasheet: https://atta.szlcsc.com/upload/public/pdf/source/20250103/C44077DA9E7B3EFAE02F22B6D3D1CBC9.pdf; Supplier: LCSC; Tolerance: ±10%; Voltage Rating: 50V; Temperature Coefficient: X7R
CARD1 = TF-01A_C91145: 卡连接方式:自弹式;卡类型:MicroSD卡(TF卡);连接器类型:卡座;本体最大高度:1.85mm;工作温度范围:-;; LCSC Part Name: 自弹式 MicroSD卡(TF卡) 卡座; Supplier Part: C91145; Manufacturer: 韩国韩荣; Supplier Footprint: SMD; JLCPCB Part Class: 扩展库; Datasheet: https://atta.szlcsc.com/upload/public/pdf/source/20190322/C91145_63CBD6FB4639A3A3EC6A9721F18AE0FB.pdf; Supplier: LCSC; Card Connection Mode: 自弹式; Card Type: MicroSD卡(TF卡); Connector Type: 卡座; Supplementary Features: 带定位柱; Maximum Body Height: 1.85mm
CN1 = PH-3AW_C2908635: 插针结构:1x3P;间距:2mm;安装方式:弯插;参考系列:PH;总PIN数:3P;排数:1;每排PIN数:3;行距:-;额定电流:2A;触头材质:黄铜;触头镀层:锡;工作温度范围:-25℃~+85℃;; LCSC Part Name: 1x3P 间距:2mm 弯插 系列:PH; Supplier Part: C2908635; Manufacturer: HCTL(华灿天禄); Supplier Footprint: 弯插,P=2mm; JLCPCB Part Class: 扩展库; Datasheet: https://atta.szlcsc.com/upload/public/pdf/source/20230320/D6ACE53C2B199F43D362B224B6022439.pdf; Supplier: LCSC; Pins Structure: 1x3P; Pitch: 2mm; Mounting Style: 弯插; Reference Series: PH; Number of Pins: 3P; Number of Rows: 1; Number of PINs Per Row: 3; Current Rating (Max): 2A; Contact Material: 黄铜; Contact Plating: 锡; Operating Temperature Range: -25℃~+85℃
H2 = PM2.54-1*4: 插孔结构:1x4P;间距:2.54mm;行距:2.54mm;圆孔/方孔:方孔;安装类型:直插;排数:单排;总孔位数:4P;额定电流:2.5A;插孔方向:顶部;塑高:8.5mm;工作温度范围:-40℃~+105℃;; LCSC Part Name: 间距:2.54mm 1x4P 直插; Supplier Part: C5116530; Manufacturer: ZHOURI(洲日); Supplier Footprint: 插件,P=2.54mm; JLCPCB Part Class: 扩展库; Datasheet: https://atta.szlcsc.com/upload/public/pdf/source/20220729/3385E3C3A9122AF204A83235A2975C64.pdf; Supplier: LCSC; Holes Structure: 1x4P; Pitch: 2.54mm; Row Spacing: 2.54mm; Circular Hole / Square Hole: 方孔; Mounting Type: 直插; Number of Rows: 单排; Number of Holes: 4P; Current Rating (Max): 2.5A; Holes Direction: 顶部; Insulation Height: 8.5mm; Operating Temperature Range: -40℃~+105℃
R26 R27 = 0603WAF100JT5E: 电阻类型:厚膜电阻;阻值:10Ω;精度:±1%;功率:100mW;最大工作电压:75V;温度系数:±400ppm/℃;; LCSC Part Name: 10Ω ±1% 100mW 厚膜电阻; Supplier Part: C22859; Manufacturer: UNI-ROYAL(厚声); Supplier Footprint: 0603; JLCPCB Part Class: 基础库; Datasheet: https://atta.szlcsc.com/upload/public/pdf/source/20200306/C422600_1E6D84923E4A46A82E41ADD87F860B5C.pdf; Supplier: LCSC; Type: 厚膜电阻; Tolerance: ±1%; Power(Watts): 100mW; Overload Voltage (Max): 75V; Temperature Coefficient: ±400ppm/℃; Operating Temperature Range: -55℃~+155℃
5V MCU2 POWER USB = YLED0603R: 发光颜色:红色;正向电压(VF):1.8V~2.4V;功率:-;正向电流:25mA;主波长:620nm~625nm;二极管配置:-;透镜颜色:-;色温:-;发光强度:-;发光角度:-;载带方式:-;工作温度:-40℃~+85℃;; Supplier Part: C19171390; Manufacturer: YONGYUTAI(永裕泰); Supplier Footprint: 0603; JLCPCB Part Class: Extended Part; Datasheet: https://atta.szlcsc.com/upload/public/pdf/source/20231027/FB19AF06E2C70028E58AB5CEDD1BDC72.pdf; Supplier: LCSC; Emitted Color: 红色; Forward Voltage (VF): 1.8V~2.4V; Forward Current: 25mA; Dominant Wavelength: 620nm~625nm; Operating Temperature: -40℃~+85℃
BT1 = nSMD100-24V: 耐压:24V;最大电流:100A;保持电流(Ih):1A;跳闸电流:1.8A;; LCSC Part Name: 24V 1A 1206自恢复; Supplier Part: C2937114; Manufacturer: 台湾陆海; Supplier Footprint: 1206; JLCPCB Part Class: 扩展库; Datasheet: https://atta.szlcsc.com/upload/public/pdf/source/20230404/0F789FF6D057CDB47E26CF0B04785DBA.pdf; Supplier: LCSC; Voltage - Max: 24V; Current - Max: 100A; Hold Current: 1A; Trip Current: 1.8A; Power Dissipation: 600mW; Resistance - Initial (Ri) (Min): 55mΩ; Resistance - Post Trip (R1) (Max): 270mΩ; Time to Trip(Max): 300ms; Operating Temperature: -40℃~+85℃
C9 C10 = CL10A226MQ8NRNC: 容值:22uF;精度:±20%;额定电压:6.3V;材质(温度系数):X5R;; LCSC Part Name: 22uF ±20% 6.3V; Supplier Part: C59461; Manufacturer: SAMSUNG(三星); Supplier Footprint: 0603; JLCPCB Part Class: Basic Part; Datasheet: https://atta.szlcsc.com/upload/public/pdf/source/20160218/1457707763339.pdf; Supplier: LCSC; Tolerance: ±20%; Voltage Rated: 6.3V; Temperature Coefficient: X5R
C36 = TAJA106K016RNJ: 容值:10uF;精度:±10%;额定电压:16V;等效串联电阻:3Ω@100kHz;; LCSC Part Name: 10uF ±10% 16V; Supplier Part: C7171; Manufacturer: Kyocera AVX; Supplier Footprint: CASE-A-3216; Datasheet: https://atta.szlcsc.com/upload/public/pdf/source/20160107/1457707750344.pdf; Supplier: LCSC; Tolerance: ±10%; Rated Voltage: 16V; Equivalent Series Resistance(ESR): 3Ω@100kHz; Operating Temperature: -55℃~+125℃
C64 = HGC1206R5106K500NSPJ: 容值:10uF;精度:±10%;额定电压:50V;温度系数:X5R;; LCSC Part Name: 10uF ±10% 50V; Supplier Part: C7432781; Manufacturer: Chinocera(华瓷); Supplier Footprint: 1206; JLCPCB Part Class: 扩展库; Datasheet: https://atta.szlcsc.com/upload/public/pdf/source/20240320/FAC3FEC40A78BC5CCCE96C232A94D860.pdf; Supplier: LCSC; Tolerance: ±10%; Voltage Rating: 50V; Temperature Coefficient: X5R
C66 = TAJA226K010RNJ: 容值:22uF;精度:±10%;额定电压:10V;等效串联电阻(ESR):3Ω@100kHz;; LCSC Part Name: 22uF ±10% 10V; Supplier Part: C11366; Manufacturer: Kyocera AVX; Supplier Footprint: CASE-A-3216-18(mm); JLCPCB Part Class: 扩展库; Supplier: LCSC; Tolerance: ±10%; Voltage Rating: 10V; Equivalent Series Resistance(ESR): 3Ω@100kHz; Operating Temperature: -55℃~+125℃
D1 = 20CJQ100: 二极管配置:1对共阴极;正向压降(Vf):800mV@1A;直流反向耐压(Vr):100V;平均整流电流(Io):1A;; LCSC Part Name: 电压:100V 电流:1A; Supplier Part: C260230; Manufacturer: SMC(桑德斯); Supplier Footprint: SOT-223-3; JLCPCB Part Class: 扩展库; Datasheet: https://atta.szlcsc.com/upload/public/pdf/source/20181009/C260230_E5324CB3AAD8CD0559EEA805D21A5860.pdf; Supplier: LCSC; Diode Configuration: 1对共阴极; Forward Voltage (Vf@If): 800mV@1A; Reverse Voltage (Vr): 100V; Average Rectified Current (Io): 1A; Reverse Leakage Current (Ir): 300nA@100V
DC1 = DC-005-5A-2.5: 连接器类型:DC电源插座;安装方式:弯插;触点内径:2.5mm;触点外径:6.5mm;额定电流:5A;额定电压:24V;工作温度范围:-20℃~+70℃;; LCSC Part Name: DC电源插座 内径:2.5mm 外径:6.5mm; Supplier Part: C381115; Manufacturer: XKB Connection(中国星坤); Supplier Footprint: 插件; JLCPCB Part Class: 扩展库; Datasheet: https://atta.szlcsc.com/upload/public/pdf/source/20220930/9F6B678D272419D8FE16D336E354A545.pdf; Supplier: LCSC; Connector Type: DC电源插座; Mounting Style: 弯插; Inside Contact Diameter: 2.5mm; Outside Contact Diameter: 6.5mm; Current Rating (Max): 5A; Voltage Rating (Max): 24V; Operating Temperature Range: -20℃~+70℃
F1 = 2920L400/30GR: 最大电压:30V;最大电流:40A;保持电流:4A;跳闸电流:8A;; LCSC Part Name: 30V 4A 2920自恢复; Supplier Part: C19078761; Manufacturer: LUTE(陆特); Supplier Footprint: 2920; JLCPCB Part Class: 扩展库; Datasheet: https://atta.szlcsc.com/upload/public/pdf/source/20231025/78BDE9E7E55298A50DE7DABF843D76D1.pdf; Supplier: LCSC; Operating Voltage (Max): 30V; Current Rating (Max): 40A; Hold Current: 4A; Trip Current: 8A; Power Dissipation: 2.5W; Resistance - Initial (Ri) (Min): 8mΩ; Resistance - Post Trip (R1) (Max): 40mΩ; Maximum Time to Trip: 4s; Operating Temperature: -40℃~+85℃
F2 = SL0805200: 耐压:6V;最大电流:50A;保持电流(Ih):2A;跳闸电流:4A;; LCSC Part Name: 6V 2A 0805自恢复; Supplier Part: C70158; Manufacturer: 台湾陆海; Supplier Footprint: 0805; JLCPCB Part Class: 扩展库; Datasheet: https://atta.szlcsc.com/upload/public/pdf/source/20160823/1471947506254.pdf; Supplier: LCSC; Voltage - Max: 6V; Current - Max: 50A; Hold Current: 2A; Trip Current: 4A; Power Dissipation: 1W; Resistance - Initial (Ri) (Min): 8mΩ; Resistance - Post Trip (R1) (Max): 55mΩ; Time to Trip(Max): 5s; Operating Temperature: -40℃~+70℃
L3 = SL0420-4R7M: 电感值:4.7uH;精度:±20%;额定电流:3A;饱和电流(Isat):3.5A;; LCSC Part Name: 4.7uH ±20% 3.5A; Supplier Part: C22463808; Manufacturer: 台湾陆海; Supplier Footprint: SMD,4.5x4.1mm; JLCPCB Part Class: 扩展库; Datasheet: https://atta.szlcsc.com/upload/public/pdf/source/20240611/8DE7D6BE1273F2E871C82A6D5C20B08D.pdf; Supplier: LCSC; Tolerance: ±20%; Rated Current: 3A; Saturation Current (Isat): 3.5A
R5 R29 R30 = 0603WAF5101T5E: 电阻类型:厚膜电阻;阻值:5.1kΩ;精度:±1%;功率:100mW;最大工作电压:75V;温度系数:±100ppm/℃;; LCSC Part Name: 5.1kΩ ±1% 100mW 厚膜电阻; Supplier Part: C23186; Manufacturer: UNI-ROYAL(厚声); Supplier Footprint: 0603; JLCPCB Part Class: Basic Part; Datasheet: https://atta.szlcsc.com/upload/public/pdf/source/20200306/C422600_1E6D84923E4A46A82E41ADD87F860B5C.pdf; Supplier: LCSC; Type: 厚膜电阻; Tolerance: ±1%; Power(Watts): 100mW; Overload Voltage (Max): 75V; Temperature Coefficient: ±100ppm/℃; Operating Temperature Range: -55℃~+155℃
R6 R9 R10 = 0603WAF6800T5E: 电阻类型:厚膜电阻;阻值:680Ω;精度:±1%;功率:100mW;最大工作电压:75V;温度系数:±100ppm/℃;; LCSC Part Name: 680Ω ±1% 100mW 厚膜电阻; Supplier Part: C23228; Manufacturer: UNI-ROYAL(厚声); Supplier Footprint: 0603; JLCPCB Part Class: Basic Part; Datasheet: https://atta.szlcsc.com/upload/public/pdf/source/20200306/C422600_1E6D84923E4A46A82E41ADD87F860B5C.pdf; Supplier: LCSC; Type: 厚膜电阻; Tolerance: ±1%; Power(Watts): 100mW; Overload Voltage (Max): 75V; Temperature Coefficient: ±100ppm/℃; Operating Temperature Range: -55℃~+155℃
TP1-TP3 = Test-Point: Test Point 测试点
U18 = AMS1117-3.3_C6186: 输出类型:固定;工作电压:-;输出电压:3.3V;输出电流:1A;电源纹波抑制比(PSRR):72dB@(120Hz);输出极性:正极;; LCSC Part Name: 输出3.3V 1A; Supplier Part: C6186; Manufacturer: AMS; Supplier Footprint: SOT-223; JLCPCB Part Class: 基础库; Datasheet: https://atta.szlcsc.com/upload/public/pdf/source/20180727/C6186_7A095716F0823C02F1997A905E26C086.pdf; Supplier: LCSC; Output Type: 固定; Output Voltage: 3.3V; Output Current: 1A; Power Supply Rejection Ratio (PSRR): 72dB@(120Hz); Voltage Dropout: 1.3V@(800mA); Features: 过流保护(OCP)；热保护(TSD); Output Configuration: 正极; Number of Outputs: 1
U33 = AP63205WU-7: 功能类型:降压型;输出类型:固定;输入电压:3.8V~32V;输出电压:5V;输出电流:2A;; LCSC Part Name: 3.8V至32V输入、2A低静态电流同步降压转换器，增强EMI抑制; Supplier Part: C2071056; Manufacturer: DIODES(美台); Supplier Footprint: TSOT-23-6; JLCPCB Part Class: 扩展库; Datasheet: https://atta.szlcsc.com/upload/public/pdf/source/20210622/C780769_099C67289BD3EC61AAFB52D8B07125B3.pdf; Supplier: LCSC; Function: 降压型; Output Type: 固定; Input Voltage: 3.8V~32V; Output Voltage: 5V; Output Current: 2A; Switching Frequency: 1.1MHz; Operating Temperature: -40℃~+85℃@(TA); Synchronous Rectification: 是; Number of Outputs: 1; Topology: 降压式; Quiescent Current (Iq): 22uA; Switch tube (built-in/external): 内置
U38 = SMAJ28CA_C19077546: 极性:双向;反向截止电压(Vrwm):28V;钳位电压:45.4V;峰值脉冲电流(Ipp):8.8A;峰值脉冲功率(Ppp):400W;击穿电压:34.4V;; Supplier Part: C19077546; Manufacturer: 宏嘉诚; Supplier Footprint: SMA; JLCPCB Part Class: 扩展库; Datasheet: https://atta.szlcsc.com/upload/public/pdf/source/20250107/539D2DC1EE5F9F3FCEFE35DA61E92AD9.pdf; Supplier: LCSC; Polarity: 双向; Reverse Stand-Off Voltage (Vrwm): 28V; Clamping Voltage: 45.4V; Peak Pulse Current (Ipp): 8.8A; Peak Pulse Power Dissipation (Ppp): 400W; Voltage - Breakdown: 34.4V; Reverse Leakage Current (Ir): 1uA; Type: TVS
U40 = H3V3LD5B: 极性:双向;反向截止电压(Vrwm):3.3V;最大钳位电压:12V;峰值脉冲电流(Ipp):8A;峰值脉冲功率(Ppp):100W;击穿电压:6.5V;; LCSC Part Name: 丝印:3C; Supplier Part: C20615817; Manufacturer: 宏迦橙; Supplier Footprint: SOD-523; JLCPCB Part Class: 扩展库; Datasheet: https://atta.szlcsc.com/upload/public/pdf/source/20240403/D66EE83449BEC8A81D831854A18235E3.pdf; Supplier: LCSC; polarity: 双向; Reverse Stand-Off Voltage (Vrwm): 3.3V; Maximum Clamping Voltage: 12V; Peak Pulse Current (Ipp): 8A; Peak Pulse Power Dissipation (Ppp): 100W; Breakdown Voltage: 6.5V; Reverse Leakage Current (Ir): 200nA; Operating Temperature: -55℃~+155℃; Type: ESD
U42 = SS-12M12G5: 电路结构:单刀双掷;安装方式:弯插;开关颜色:黑色;额定电流(DC):6A;额定电压(DC):120V;额定电流(AC):6A;额定电压(AC):120V;机械寿命:1万次;; LCSC Part Name: 柄长5mm 弯插双档 滑动开关; Supplier Part: C2884789; Manufacturer: XKB Connectivity(中国星坤); Supplier Footprint: 插件; JLCPCB Part Class: 扩展库; Datasheet: https://atta.szlcsc.com/upload/public/pdf/source/20211009/F44B934214AE410D67AA0A05A88FD376.pdf; Supplier: LCSC; Circuit: 单刀双掷; Actuator Style: 矩形柱状; Pin Style: PC引脚; Switch Length: 13.2mm; Switch Width: 7.2mm; Switch Height: 6.6mm; Mounting Style: 弯插; Actuator Color: 黑色; Current Rating (DC): 6A; Voltage Rating (DC): 120V; Current Rating (AC): 6A; Voltage Rating (AC): 120V; Mechanical Life: 1万次; Operating Temperature: -40℃~+85℃
USBC1 = TYPE-C-31-M-12: 连接器类型:Type-C;标准:-;公母:母;安装方式:-;触点数量:16P;端口数量:1;额定电流 - 电源:5A;工作温度范围:-;; LCSC Part Name: Type-C 母; Supplier Part: C165948; Manufacturer: 韩国韩荣; Supplier Footprint: SMD; Datasheet: https://atta.szlcsc.com/upload/public/pdf/source/20220525/466408E853115E789EDB0DDC29077C05.pdf; Supplier: LCSC; Connector Type: Type-C; Gender: 母; Number of Contacts: 16P; Number of Ports: 1; Current Rating - Power (Max): 5A
C1 = CL10A105KB8NNNC: 容值:1uF;精度:±10%;额定电压:50V;材质(温度系数):X5R;; LCSC Part Name: 1uF ±10% 50V; Supplier Part: C15849; Manufacturer: SAMSUNG(三星); Supplier Footprint: 0603; JLCPCB Part Class: Basic Part; Datasheet: https://atta.szlcsc.com/upload/public/pdf/source/20160218/1457707763339.pdf; Supplier: LCSC; Tolerance: ±10%; Voltage Rated: 50V; Temperature Coefficient: X5R
C65 = TCC0603X7R684K500CT: 容值:680nF;精度:±10%;额定电压:50V;温度系数:X7R;; LCSC Part Name: 680nF ±10% 50V; Supplier Part: C5360852; Manufacturer: CCTC(三环); Supplier Footprint: 0603; JLCPCB Part Class: 扩展库; Datasheet: https://atta.szlcsc.com/upload/public/pdf/source/20191203/C466239_F62A586702D44EEA1C39B32FC8662B21.pdf; Supplier: LCSC; Tolerance: ±10%; Voltage Rating: 50V; Temperature Coefficient: X7R
D2 = USBLC6-2SC6_C2827654: 极性:单向;反向截止电压(Vrwm):5V;最大钳位电压:12V;峰值脉冲电流(Ipp):6A;峰值脉冲功率(Ppp):150W;击穿电压:6V;; LCSC Part Name: ESD，可防30kV静电; Supplier Part: C2827654; Manufacturer: TECH PUBLIC(台舟); Supplier Footprint: SOT-23-6; JLCPCB Part Class: 扩展库; Datasheet: https://atta.szlcsc.com/upload/public/pdf/source/20210810/FBD75DE717D6D97BAC6DD7F2B5C09DCD.pdf; Supplier: LCSC; polarity: 单向; Reverse Stand-Off Voltage (Vrwm): 5V; Maximum Clamping Voltage: 12V; Peak Pulse Current (Ipp): 6A; Peak Pulse Power Dissipation (Ppp): 150W; Breakdown Voltage: 6V; Reverse Leakage Current (Ir): 80nA; Number of Lines: 双路; Operating Temperature: -55℃~+125℃; level of protection: IEC 61000-4-2; Type: ESD
LED1 = YLED0603B: 发光颜色:蓝色;正向电压(VF):2.6V~3.2V;功率:-;正向电流:30mA;主波长:460nm~475nm;发光角度:120°;工作温度:-40℃~+85℃;; Supplier Part: C19171394; Manufacturer: YONGYUTAI(永裕泰); Supplier Footprint: 0603; JLCPCB Part Class: Extended Part; Datasheet: https://atta.szlcsc.com/upload/public/pdf/source/20231027/6134FF4BA718E32A802654BBC76F69A6.pdf; Supplier: LCSC; Emitted Color: 蓝色; Forward Voltage (VF): 2.6V~3.2V; Forward Current: 30mA; Dominant Wavelength: 460nm~475nm; Viewing Angle: 120°; Operating Temperature: -40℃~+85℃
Q1 Q2 = MMS8050-H-TP: 晶体管类型:NPN;集电极电流(Ic):500mA;集射极击穿电压(Vceo):25V;耗散功率(Pd):300mW;直流电流增益(hFE):120@50mA,1V;; Supplier Part: C668971; Manufacturer: MCC(美微科); Supplier Footprint: SOT-23; JLCPCB Part Class: 扩展库; Datasheet: https://atta.szlcsc.com/upload/public/pdf/source/20200618/C668971_E8C4278A0C61D2294D468F2197C24659.pdf; Supplier: LCSC; type: NPN; Current - Collector(Ic): 500mA; Collector - Emitter Voltage VCEO: 25V; Pd - Power Dissipation: 300mW; DC Current Gain: 120@50mA,1V; Transition frequency(fT): 150MHz; Current - Collector Cutoff: 100nA; Vce Saturation(VCE(sat)): 600mV; Operating Temperature: -55℃~+150℃@(Tj)
R33 R39 = 0603WAF1000T5E: 电阻类型:厚膜电阻;阻值:100Ω;精度:±1%;功率:100mW;最大工作电压:75V;温度系数:±200ppm/℃;; LCSC Part Name: 100Ω ±1% 100mW 厚膜电阻; Supplier Part: C22775; Manufacturer: UNI-ROYAL(厚声); Supplier Footprint: 0603; JLCPCB Part Class: 基础库; Datasheet: https://atta.szlcsc.com/upload/public/pdf/source/20200306/C422600_1E6D84923E4A46A82E41ADD87F860B5C.pdf; Supplier: LCSC; Type: 厚膜电阻; Tolerance: ±1%; Power(Watts): 100mW; Overload Voltage (Max): 75V; Temperature Coefficient: ±200ppm/℃; Operating Temperature Range: -55℃~+155℃
SW1 SW2 = TS24CA: 电路结构:单刀单掷;按钮形状:矩形按钮;安装方式:卧贴;开关长度:4.55mm;开关宽度:1.8mm;开关高度:3.5mm;触点电流:50mA;额定电压(DC):12V;带灯:-;机械寿命:-;; LCSC Part Name: 4.55*1.8*3.5mm 卧贴 轻触开关; Supplier Part: C393942; Manufacturer: SHOU HAN(首韩); Supplier Footprint: SMD; JLCPCB Part Class: 扩展库; Datasheet: https://atta.szlcsc.com/upload/public/pdf/source/20190521/C393942_591A9E318887EFA4274D34029981AD99.pdf; Supplier: LCSC; Circuit: 单刀单掷; Actuator Style: 矩形按钮; Mounting Style: 卧贴; Switch Length: 4.55mm; Switch Width: 1.8mm; Switch Height: 3.5mm; Contact Current: 50mA; Voltage Rating (DC): 12V
U1 = CH343P: 应用功能:-;接口协议:-;; Supplier Part: C2846043; Manufacturer: WCH(南京沁恒); Supplier Footprint: TQFN-16-EP(3x3); Datasheet: https://atta.szlcsc.com/upload/public/pdf/source/20211010/C2846043_7FA705E1F14A2906F6A2AFA45FA28209.pdf; Supplier: LCSC
U49 = YLED0603G: 发光颜色:翠绿色;正向电压(VF):2.7V~3.2V;功率:-;正向电流:25mA;主波长:510nm~531nm;二极管配置:-;透镜颜色:-;色温:-;发光强度:-;发光角度:-;载带方式:-;工作温度:-40℃~+85℃;; Supplier Part: C19273151; Manufacturer: YONGYUTAI(永裕泰); Supplier Footprint: 0603; JLCPCB Part Class: Extended Part; Datasheet: https://atta.szlcsc.com/upload/public/pdf/source/20231201/6896CD173B7817C61CFF421DECB2B9C4.pdf; Supplier: LCSC; Emitted Color: 翠绿色; Forward Voltage (VF): 2.7V~3.2V; Forward Current: 25mA; Dominant Wavelength: 510nm~531nm; Operating Temperature: -40℃~+85℃

## Nets
3V3: BT1.2 C37.2 C47.2 C54.2 C61.2 C62.1 CARD1.4(VDD) H2.2 H6.2 MCU2.1(+) R9.2 R10.2 R23.2 R35.2 R44.2 R49.2 U1.1(VIO) U19.15(VCC_IO) U26.9(MS1_AD0) U26.15(VCC_IO) U28.10(MS2_AD1) U28.15(VCC_IO) U46.1
5V: 5V.1(+) D1.2(C) D1.4(C) H6.29 U48.1
5VBUCK: CN1.2 D1.3(A) F2.2
GND: C1.2 C2.1 C9.1 C10.1 C36.2 C37.1 C41.1 C42.1 C43.2 C46.1 C47.1 C48.1 C49.1 C52.1 C53.2 C54.1 C55.1 C56.1 C59.1 C60.2 C61.1 C62.2 C64.1 C65.2 C66.2 CARD1.6(VSS) CARD1.10(GND) CARD1.11(GND) CARD1.12(GND) CARD1.13(GND) CN1.3 D2.2(GND) DC1.2 H2.1 H6.1 H6.31 H6.32 R4.2 R5.2 R6.2 R29.2 R30.2 R33.1 R39.1 R40.2 R41.2 R45.2 R46.2 R47.2 R48.2 R51.2 SW1.1 SW1.2 SW2.1 SW2.2 U1.2(GND) U1.17(EP) U18.1(GND) U19.3(GND) U19.9(MS1_AD0) U19.10(MS2_AD1) U19.13(CLK) U19.18(GND) U19.25(UNUSED) U19.29(EP) U26.3(GND) U26.10(MS2_AD1) U26.13(CLK) U26.18(GND) U26.25(UNUSED) U26.29(EP) U28.3(GND) U28.9(MS1_AD0) U28.13(CLK) U28.18(GND) U28.25(UNUSED) U28.29(EP) U33.4(GND) U38.1 U40.1 U52.1(GND) U52.15(GND) U52.38(GND) U52.39(GND) USBC1.0(SH) USBC1.1(SH) USBC1.2(SH) USBC1.3(SH) USBC1.A1(GND) USBC1.A12(GND) USBC1.B1(GND) USBC1.B12(GND)
VBUS: C1.1 D1.1(A) D2.5(VBUS) TP3.1 U1.3(VDD5) U1.9(VBUS) USB.1(+) USBC1.A4(VBUS) USBC1.A9(VBUS) USBC1.B4(VBUS) USBC1.B9(VBUS)
VIN: C41.2 C42.2 C43.1 C45.1 C48.2 C49.2 C51.1 C53.1 C55.2 C56.2 C58.1 C60.1 F1.1 POWER.1(+) U19.22(VS) U19.28(VS) U26.22(VS) U26.28(VS) U28.22(VS) U28.28(VS) U47.1
CC1: R30.1 USBC1.A5(CC1)
CC2: R29.1 USBC1.B5(CC2)
CD: CARD1.9(CD) H6.27 U52.16(IO13)
CLK: CARD1.5(CLK(SCLK)) R26.1
CMD: CARD1.3(CMD(DI)) R27.1
CS: CARD1.2(CDDAT3(CS)) H6.16 U52.29(IO5)
D+: D2.4(IO2) U1.7(UD+)
D-: D2.6(IO1) U1.8(UD-)
DAT0: CARD1.7(DAT0(D0)) H6.20 R23.1 U52.31(IO19)
DN: D2.1(IO1) USBC1.A7(DN1) USBC1.B7(DN2)
DP: D2.3(IO2) USBC1.A6(DP1) USBC1.B6(DP2)
DTR: Q2.2(E) R36.2 TP1.1 U1.12(DTRTNOW)
EN: C65.1 H6.13 Q1.3(C) R35.1 SW1.3 U52.3(EN)
IO0: H6.8 Q2.3(C) R38.2 U52.25(IO0)
IO2: H6.6 U28.16(STEP) U52.24(IO2)
IO4: CN1.1 H6.10 U52.26(IO4)
IO12: H6.25 U28.2(ENN) U52.14(IO12)
IO14: H6.23 U26.16(STEP) U52.13(IO14)
IO15: H6.4 U28.19(DIR) U52.23(IO15)
IO16: H6.12 R11.1 U19.14(PDN_UART) U26.14(PDN_UART) U28.14(PDN_UART) U52.27(IO16)
IO17: H6.14 R11.2 U52.28(IO17)
IO18: H6.18 R26.2 U52.30(IO18)
IO21: H2.4 H6.22 U52.33(IO21)
IO22: H2.3 H6.28 U52.36(IO22)
IO23: H6.30 R27.2 U52.37(IO23)
IO25: H6.17 U19.16(STEP) U52.10(IO25)
IO26: H6.19 R49.1 U26.2(ENN) U52.11(IO26)
IO27: H6.21 U26.19(DIR) U52.12(IO27)
IO32: H6.3 R44.1 U19.2(ENN) U52.8(IO32)
IO33: H6.15 U19.19(DIR) U52.9(IO33)
IO34: H6.7 U52.6(IO34)
IO35: H6.5 U52.7(IO35)
M0OA+: U19.24(OA1) U53.1
M0OA-: U19.21(OA2) U53.2
M0OB+: U19.26(OB1) U53.3
M0OB-: U19.1(OB2) U53.4
M1OA+: U26.24(OA1) U55.1
M1OA-: U26.21(OA2) U55.2
M1OB+: U26.26(OB1) U55.3
M1OB-: U26.1(OB2) U55.4
M2OA+: U28.24(OA1) U56.1
M2OA-: U28.21(OA2) U56.2
M2OB+: U28.26(OB1) U56.3
M2OB-: U28.1(OB2) U56.4
RTS: Q1.2(E) R37.2 TP2.1 U1.13(RTS)
RXD0: H6.24 LED1.2(K) U1.4(TXD) U52.34(RXD0)
TXD0: H6.26 U1.5(RXD) U49.2(-) U52.35(TXD0)
VN: H6.9 U52.5(SENSOR_VN)
VP: H6.11 U52.4(SENSOR_VP)
$1N2004: U46.2 U52.2(3V3)
$2N678: C44.2 U19.4(CPO)
$2N1810: R40.1 U19.23(BRA)
$2N25649: C50.2 U26.4(CPO)
$2N25650: C52.2 U26.8(5VOUT)
$2N25653: C50.1 U26.5(CPI)
$2N25654: C51.2 U26.6(VCP)
$2N25667: R46.1 U26.23(BRA)
$2N25668: R45.1 U26.27(BRB)
$2N26519: C57.2 U28.4(CPO)
$2N26520: C59.2 U28.8(5VOUT)
$2N26523: C57.1 U28.5(CPI)
$2N26524: C58.2 U28.6(VCP)
$2N26537: R48.1 U28.23(BRA)
$2N40810: C44.1 U19.5(CPI)
$2N40851: C45.2 U19.6(VCP)
$2N40853: C46.2 U19.8(5VOUT)
$2N42197: R41.1 U19.27(BRB)
$2N47460: R47.1 U28.27(BRB)
$3N814: C9.2 C10.2 F2.1 L3.2 U33.1(FB)
$3N816: C8.2 L3.1 U33.5(SW)
$3N819: C64.2 U33.2(EN) U33.3(VIN) U47.2
$3N821: BT1.1 C66.1 U18.2(VOUT) U18.4(VOUT) U40.2
$3N1344: POWER.2(-) R5.1
$3N1346: R4.1 USB.2(-)
$3N12295: C8.1 U33.6(BST)
$3N15356: F1.2 U38.2 U42.2
$3N15365: DC1.1 U42.1
$3N30933: C36.1 U18.3(VIN) U48.2
$3N43041: MCU2.2(-) R6.1
$3N43183: 5V.2(-) R51.1
$4N1482: Q1.1(B) R36.1
$4N1521: Q2.1(B) R37.1
$4N2394: R39.2 SW2.4
$4N2398: R38.1 SW2.3
$4N2404: R33.2 SW1.4
$4N3230: R10.1 U49.1(+)
$4N3238: LED1.1(A) R9.1
$4N5658: C2.2 U1.6(V3)

Not connected (* = marked no-connect by the designer): CARD1 1(DAT2(RSV))* 8(DAT1(RSV))*; DC1 3*; U1 10(ACT#)* 11(DCD)* 14(DSR)* 15(CTS)* 16(RI)*; U19 7(SPREAD)* 11(DIAG)* 12(INDEX)* 17(VREF)* 20(STDBY)*; U26 7(SPREAD)* 11(DIAG)* 12(INDEX)* 17(VREF)* 20(STDBY)*; U28 7(SPREAD)* 11(DIAG)* 12(INDEX)* 17(VREF)* 20(STDBY)*; U42 3*; U52 17(NC)* 18(NC)* 19(NC)* 20(NC)* 21(NC)* 22(NC)* 32(NC)*; USBC1 A8(SBU1)* B8(SBU2)*

## Notes on the sheets
sheet 1
- MCU
- Pins
- 跳帽 C501335
- * 管脚 SCK/CLK，SDO/SD0，SDI/SD1，SHD/SD2，
  SWP/SD3，和 SCS/CMD，即 GPIO6 至 GPIO11 用于连接模组上集成的 SPI flash，不建议用于其他功能。
- https://www.wch.cn/application/575.html
  免外围电路的单片机串口一键下载方案
sheet 2
- Motor 0 Driver
- Motor 1 Driver
- Motor 2 Driver
- Low=StealthChop,
  High=SpreadCycle
- Low=StealthChop,
  High=SpreadCycle
- Low=StealthChop,
  High=SpreadCycle
- Microstep resolution configuration (internal pull-down resistors)
  MS2, MS1: 00: 1/8, 01: 1/32, 10: 1/64 11: 1/16
  For UART based configuration selection of UART Address 0…3
- IO12 is a strapping pin, no pull-up resistors
- TMC2209 UART
sheet 3
- Vin to 5V
- 24V Input
- 5V OR-ing
- 5V to 3.3V
- USB-C Input
- DEBUG
- TVS/ESD
sheet 4
- EN & BOOT Buttons
- USB to UART
- Indicators
sheet 5
- Micro SD
- SSD1306 OLED
- SERVO
